# EasyEDA Pro project STEP Controller.eprj, board PCB1
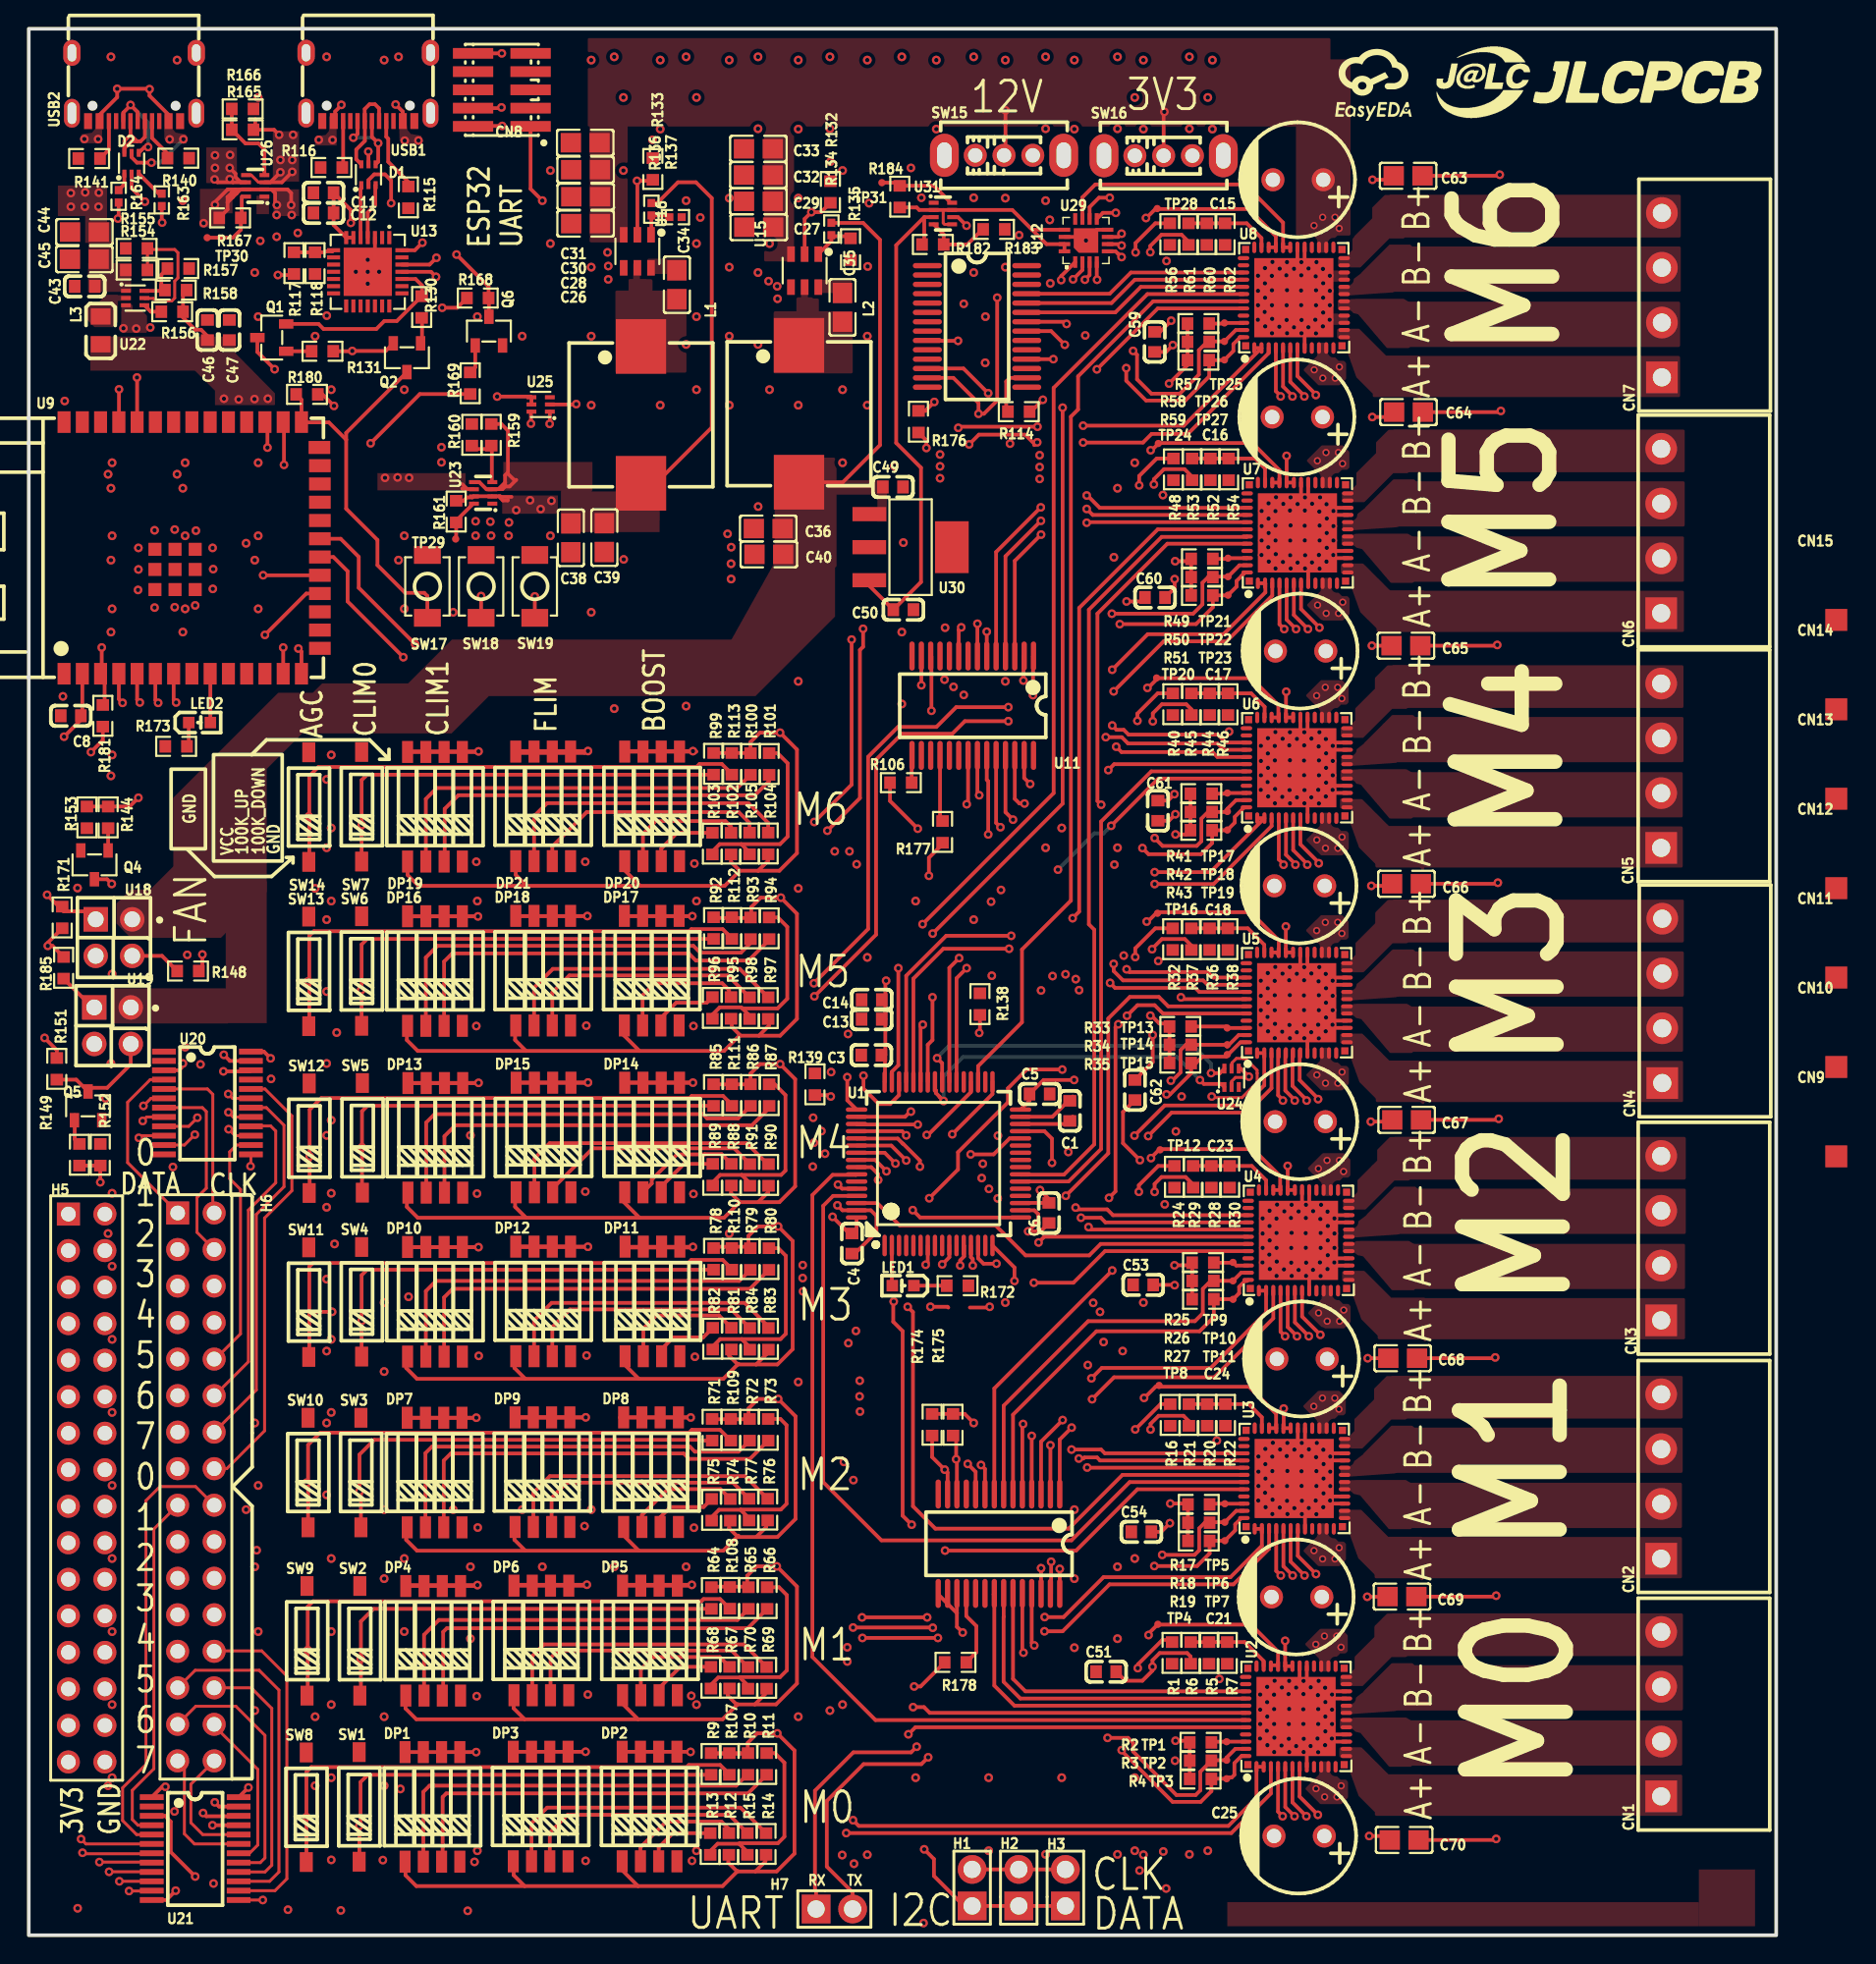
[diagram p3: board, top side]
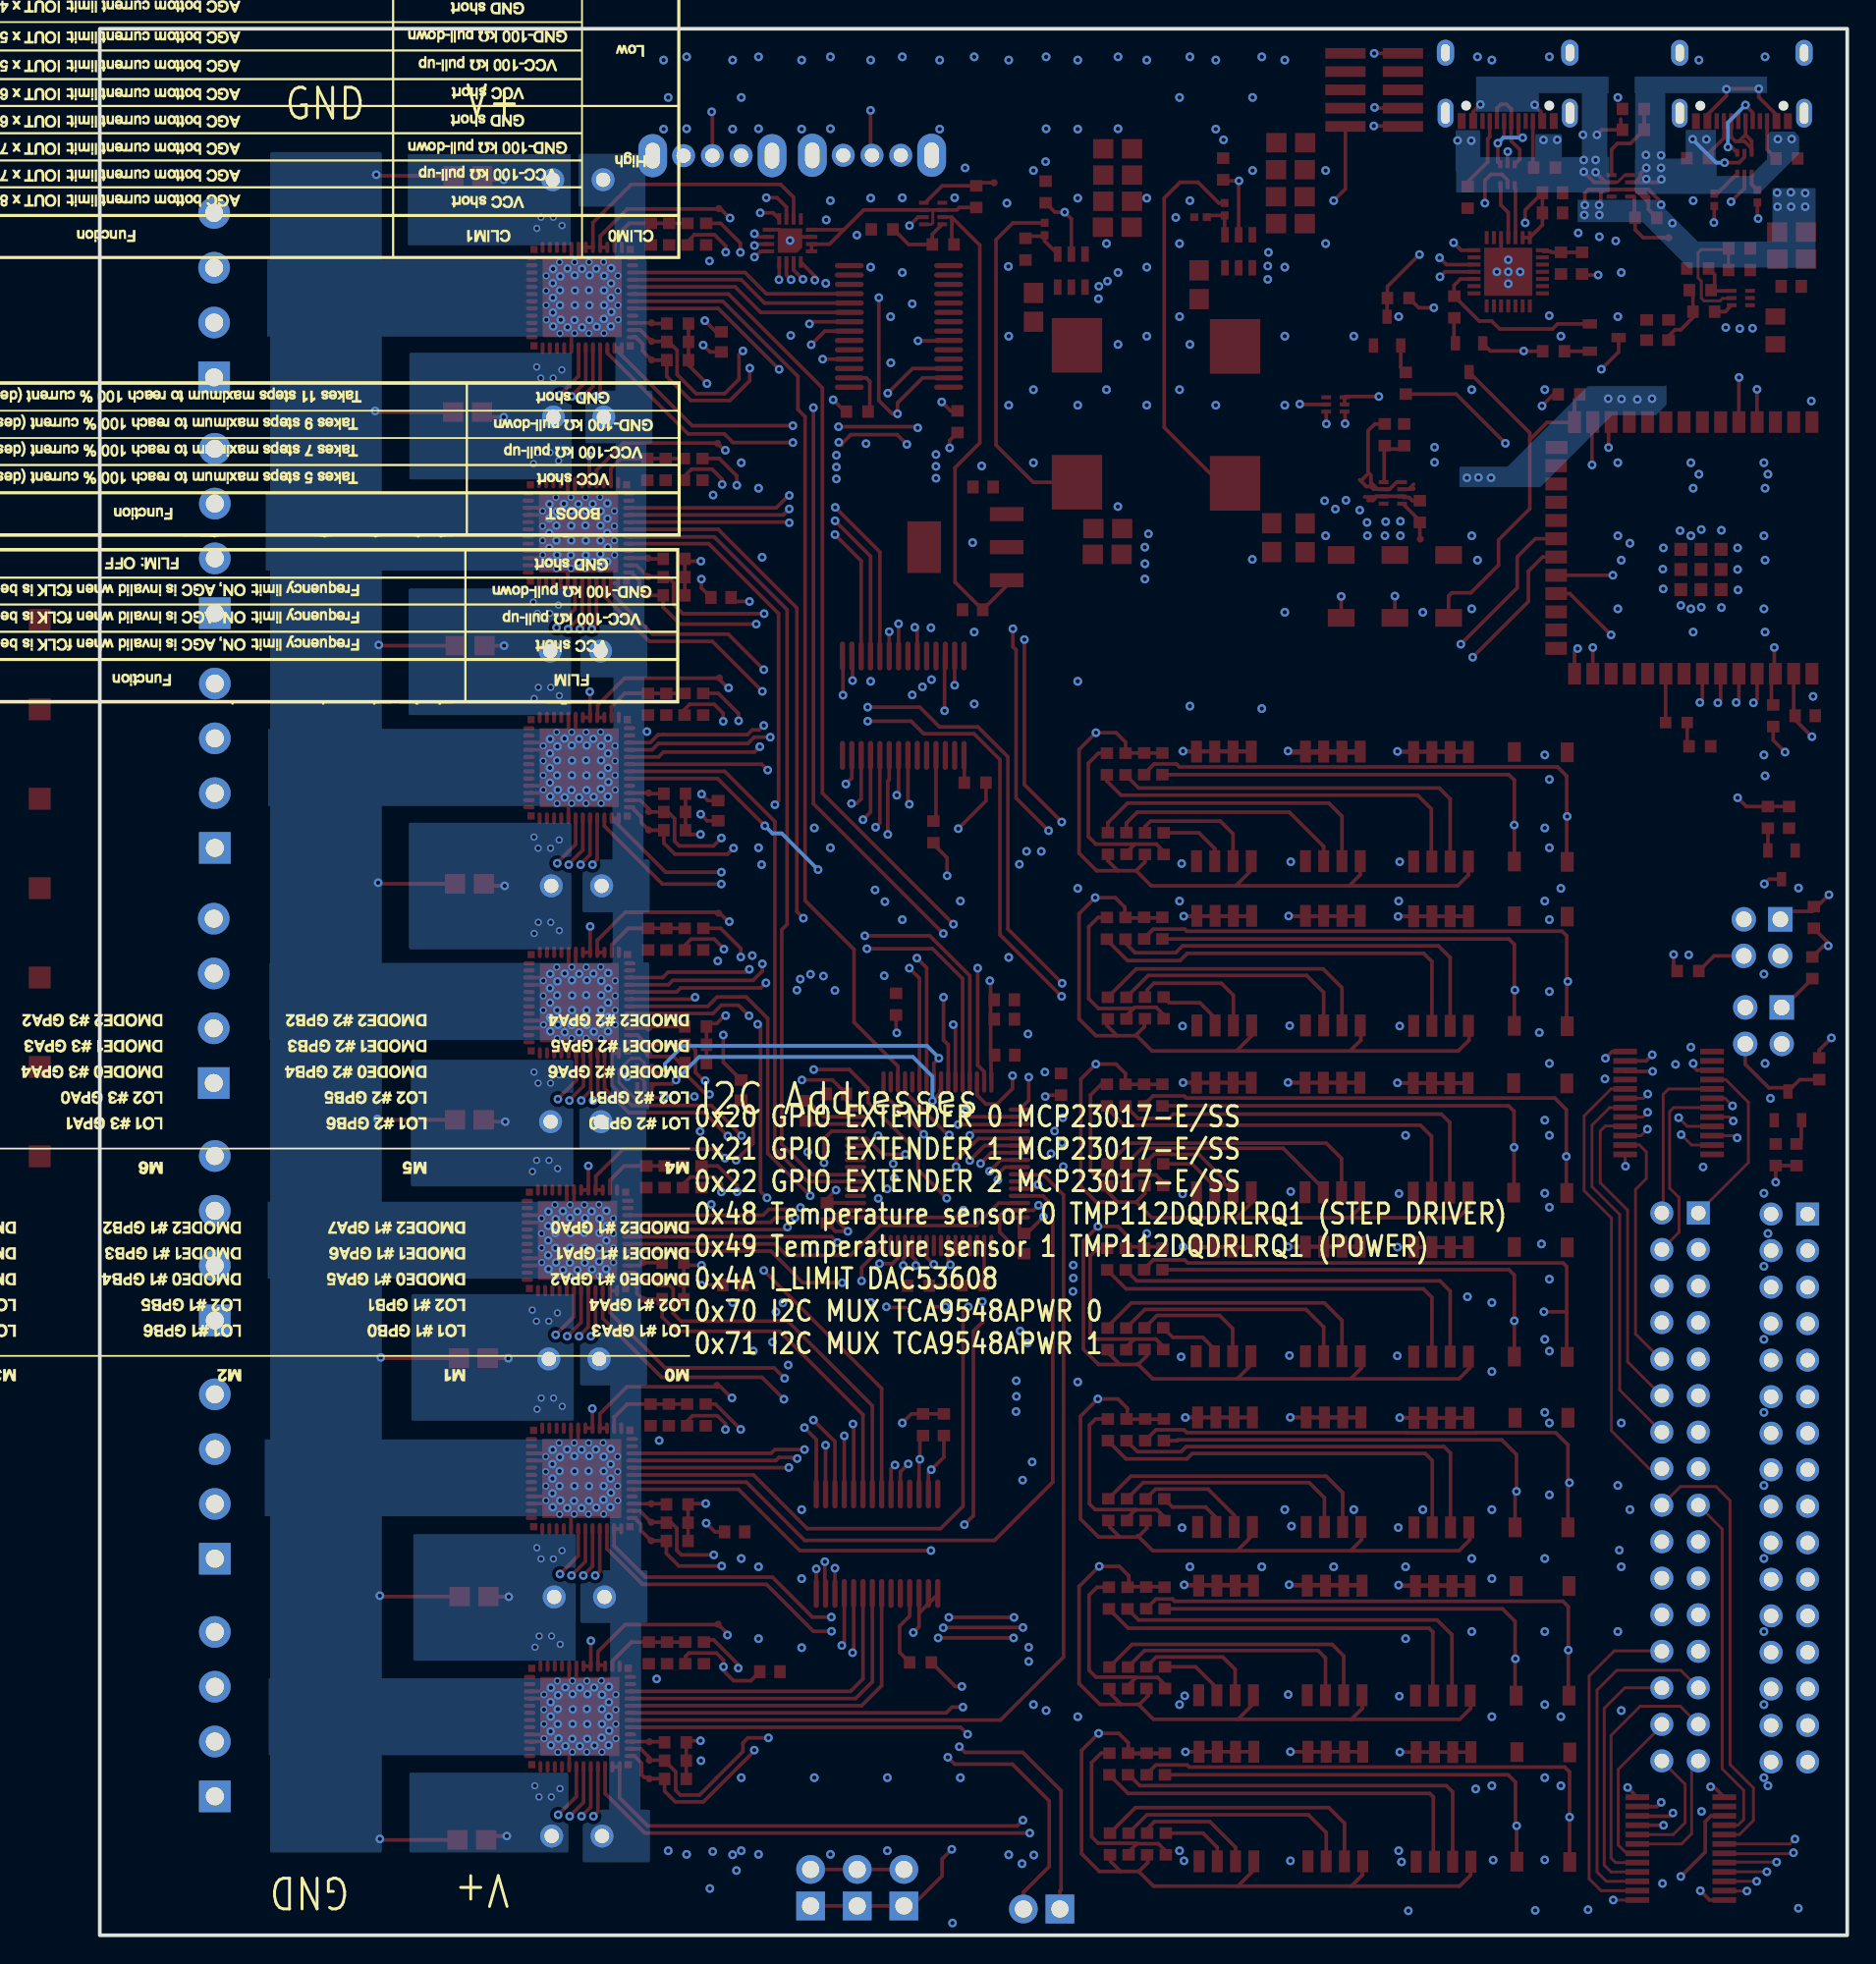
[diagram p4: board, bottom side, seen from below]

Outline 121.52 x 132.57 mm; copper layers: Top Layer, Inner1, Inner2, Bottom Layer. Coordinates in mm from the lower left corner of the outline.
Outline path: rectangle 0,132.57 121.52,0
Stack: Top Layer 0.035mm Outer layer thickness 1oz / Dielectric1 0.2104mm 7628 RC49% 8.6mil / Inner1 0.0152mm Inner layer thickness / Dielectric2 1.065mm 1.1mm H/HOZ Copper / Inner2 0.0152mm Inner layer thickness / Dielectric3 0.2104mm 7628 RC49% 8.6mil / Bottom Layer 0.035mm Outer layer thickness 1oz

## Design rules (mm)
template: Custom Config
spacing copperThickness1oz (default): track to track 0.102, other pairs 0.152 to 0.3
spacing copperThickness2oz: track to track 0.203, other pairs 0.152 to 0.3
track width copperThickness1oz (default): min 0.127, default 0.254, max 2.54
track width copperThickness2oz: min 0.203, default 0.254, max 2.54
differential pair differentialPair (default): width min 0.127, default 0.254, max 2.54; gap min 0.152, default 0.152
via viaSize (default): diameter min 0.5, default 0.61, max 10; hole min 0.3, default 0.305, max 6.3
net GND uses copperRegion1
net C6_OUT_B+ uses copperRegion1
net C7_OUT_B+ uses copperRegion1
net C7_OUT_B- uses copperRegion1
net C7_OUT_A- uses copperRegion1
net C7_OUT_A+ uses copperRegion1
net C1_OUT_A- uses copperRegion1
net C1_OUT_A+ uses copperRegion1

## Placement (name value [footprint] x y rotation side)
C1  2.2uF  [C0603]  72.4 57.32 270 top
C3  100nF  [C0603]  58.6 61.2 0 top
C4  100nF  [C0603]  57.25 48.1 90 top
C5  100nF  [C0603]  70.3 58.5 180 top
C6  100nF  [C0603]  70.95 50.23 90 top
C8  2.2uF  [C0603]  2.92 84.8 0 top
C11  4.7uF  [C0603]  20.5 121.17 0 top
C12  100nF  [C0603]  20.5 119.77 0 top
C13  100nF  [C0603]  58.62 63.7 0 top
C14  1uF  [C0603]  58.62 65.05 0 top
C15  100uF  [CAP-TH_BD8.0-P3.50-D0.6-FD_1]  88.27 122.07 180 top
C16  100uF  [CAP-TH_BD8.0-P3.50-D0.6-FD_1]  88.23 105.57 180 top
C17  100uF  [CAP-TH_BD8.0-P3.50-D0.6-FD_1]  88.45 89.3 180 top
C18  100uF  [CAP-TH_BD8.0-P3.50-D0.6-FD_1]  88.38 72.97 180 top
C21  100uF  [CAP-TH_BD8.0-P3.50-D0.6-FD_1]  88.17 23.53 180 top
C23  100uF  [CAP-TH_BD8.0-P3.50-D0.6-FD_1]  88.42 56.57 180 top
C24  100uF  [CAP-TH_BD8.0-P3.50-D0.6-FD_1]  88.55 40.07 180 top
C25  100uF  [CAP-TH_BD8.0-P3.50-D0.6-FD_1]  88.35 6.9 180 top
C26  100nF  [C0805]  38.73 119.02 0 top
C27  100nF  [C0805]  50.77 118.78 0 top
C28  1uF  [C0805]  38.73 120.9 0 top
C29  1uF  [C0805]  50.74 120.58 0 top
C30  1uF  [C0805]  38.73 122.77 0 top
C31  1uF  [C0805]  38.7 124.65 0 top
C32  1uF  [C0805]  50.74 122.4 0 top
C33  1uF  [C0805]  50.74 124.23 0 top
C34  100nF  [C0805]  45.08 114.77 90 top
C35  100nF  [C0805]  56.59 113.2 90 top
C36  10uF  [C0805]  51.43 97.82 0 top
C38  10uF  [C0805]  37.7 97.17 90 top
C39  10uF  [C0805]  40.03 97.19 90 top
C40  10uF  [C0805]  51.47 96.03 0 top
C43  100nF  [C0603]  3.89 114.66 0 top
C44  10uF  [C0805]  3.87 118.44 0 top
C45  10uF  [C0805]  3.86 116.55 0 top
C46  22uF  [C0603]  12.42 111.62 90 top
C47  100nF  [C0603]  13.95 111.62 270 top
C49  1uF  [C0603]  60.1 100.71 0 top
C50  1uF  [C0603]  60.83 92.17 180 top
C51  100nF  [C0603]  74.92 18.32 0 top
C53  100nF  [C0603]  77.5 45.22 0 top
C54  100nF  [C0603]  77.38 28.05 0 top
C59  100nF  [C0603]  78.3 110.8 270 top
C60  100nF  [C0603]  78.33 93.02 0 top
C61  100nF  [C0603]  78.52 78.2 270 top
C62  100nF  [C0603]  76.92 58.77 90 top
C63  100nF  [C0805]  95.92 122.35 180 top
C64  100nF  [C0805]  95.95 105.92 180 top
C65  100nF  [C0805]  95.77 89.67 180 top
C66  100nF  [C0805]  95.81 73.12 180 top
C67  100nF  [C0805]  95.83 56.7 180 top
C68  100nF  [C0805]  95.55 40.12 180 top
C69  100nF  [C0805]  95.5 23.55 180 top
C70  100nF  [C0805]  95.65 6.62 180 top
CN1  WJ15EDGRC-3.81-04P-14-00A  [CONN-TH_WJ15EDGRC-3.81-4P]  113.53 15.38 90 top
CN2  WJ15EDGRC-3.81-04P-14-00A  [CONN-TH_WJ15EDGRC-3.81-4P]  113.53 31.9 90 top
CN3  WJ15EDGRC-3.81-04P-14-00A  [CONN-TH_WJ15EDGRC-3.81-4P]  113.53 48.47 90 top
CN4  WJ15EDGRC-3.81-04P-14-00A  [CONN-TH_WJ15EDGRC-3.81-4P]  113.6 64.98 90 top
CN5  WJ15EDGRC-3.81-04P-14-00A  [CONN-TH_WJ15EDGRC-3.81-4P]  113.53 81.33 90 top
CN6  WJ15EDGRC-3.81-04P-14-00A  [CONN-TH_WJ15EDGRC-3.81-4P]  113.53 97.65 90 top
CN7  WJ15EDGRC-3.81-04P-14-00A  [CONN-TH_WJ15EDGRC-3.81-4P]  113.58 114.05 90 top
CN8  BH127VS-12-10-H25-L70-R  [CONN-SMD_10P-P1.27-V-M-R2-C5-LS5.8_BH127VS-12-10-H25-L70-R]  32.9 128.32 90 top
CN9  WJ15EDGK-3.81-04P-14-00A  [FL_001]  125.7 54.16 0 top
CN10  WJ15EDGK-3.81-04P-14-00A  [FL_001]  125.7 60.38 0 top
CN11  WJ15EDGK-3.81-04P-14-00A  [FL_001]  125.7 66.6 0 top
CN12  WJ15EDGK-3.81-04P-14-00A  [FL_001]  125.7 72.81 0 top
CN13  WJ15EDGK-3.81-04P-14-00A  [FL_001]  125.7 79.03 0 top
CN14  WJ15EDGK-3.81-04P-14-00A  [FL_001]  125.7 85.25 0 top
CN15  WJ15EDGK-3.81-04P-14-00A  [FL_001]  125.7 91.47 0 top
D1  USBLC6-2P6  [SOT-563_L1.6-W1.2-P0.50-LS1.6-BL]  23.62 122.42 0 top
D2  USBLC6-2P6  [SOT-563_L1.6-W1.2-P0.50-LS1.6-BL]  7.15 123.22 0 top
DP1  DSHP04TSGER  [SW-SMD_8P-L6.7-W5.4-P1.27-LS8.4]  28.08 8.92 0 top
DP2  DSHP04TSGER  [SW-SMD_8P-L6.7-W5.4-P1.27-LS8.4]  43.17 8.95 0 top
DP3  DSHP04TSGER  [SW-SMD_8P-L6.7-W5.4-P1.27-LS8.4]  35.6 8.95 0 top
DP4  DSHP04TSGER  [SW-SMD_8P-L6.7-W5.4-P1.27-LS8.4]  28.12 20.47 0 top
DP5  DSHP04TSGER  [SW-SMD_8P-L6.7-W5.4-P1.27-LS8.4]  43.2 20.5 0 top
DP6  DSHP04TSGER  [SW-SMD_8P-L6.7-W5.4-P1.27-LS8.4]  35.65 20.5 0 top
DP7  DSHP04TSGER  [SW-SMD_8P-L6.7-W5.4-P1.27-LS8.4]  28.23 32.17 0 top
DP8  DSHP04TSGER  [SW-SMD_8P-L6.7-W5.4-P1.27-LS8.4]  43.27 32.2 0 top
DP9  DSHP04TSGER  [SW-SMD_8P-L6.7-W5.4-P1.27-LS8.4]  35.73 32.2 0 top
DP10  DSHP04TSGER  [SW-SMD_8P-L6.7-W5.4-P1.27-LS8.4]  28.25 44.05 0 top
DP11  DSHP04TSGER  [SW-SMD_8P-L6.7-W5.4-P1.27-LS8.4]  43.38 44.07 0 top
DP12  DSHP04TSGER  [SW-SMD_8P-L6.7-W5.4-P1.27-LS8.4]  35.78 44.07 0 top
DP13  DSHP04TSGER  [SW-SMD_8P-L6.7-W5.4-P1.27-LS8.4]  28.28 55.45 0 top
DP14  DSHP04TSGER  [SW-SMD_8P-L6.7-W5.4-P1.27-LS8.4]  43.35 55.47 0 top
DP15  DSHP04TSGER  [SW-SMD_8P-L6.7-W5.4-P1.27-LS8.4]  35.8 55.47 0 top
DP16  DSHP04TSGER  [SW-SMD_8P-L6.7-W5.4-P1.27-LS8.4]  28.25 67.05 0 top
DP17  DSHP04TSGER  [SW-SMD_8P-L6.7-W5.4-P1.27-LS8.4]  43.33 67.07 0 top
DP18  DSHP04TSGER  [SW-SMD_8P-L6.7-W5.4-P1.27-LS8.4]  35.78 67.07 0 top
DP19  DSHP04TSGER  [SW-SMD_8P-L6.7-W5.4-P1.27-LS8.4]  28.25 78.47 0 top
DP20  DSHP04TSGER  [SW-SMD_8P-L6.7-W5.4-P1.27-LS8.4]  43.35 78.5 0 top
DP21  DSHP04TSGER  [SW-SMD_8P-L6.7-W5.4-P1.27-LS8.4]  35.78 78.5 0 top
H1  PZ254V-11-02P  [HDR-TH_2P-P2.54-V-M]  65.61 3.31 90 top
H2  PZ254V-11-02P  [HDR-TH_2P-P2.54-V-M]  68.85 3.31 90 top
H3  PZ254V-11-02P  [HDR-TH_2P-P2.54-V-M]  72.09 3.31 90 top
H5  P6E32E-602530-B1P  [HDR-TH_32P-P2.54_P6E32E-602530-B1P]  4.03 31.1 270 top
H6  P6E32E-602530-B1P  [HDR-TH_32P-P2.54_P6E32E-602530-B1P]  11.62 31.17 270 top
H7  PZ254V-11-02P  [HDR-TH_2P-P2.54-V-M]  56.02 1.82 0 top
L1  22uH  [IND-SMD_L10.0-W10.0-LS11.0]  42.58 105.72 270 top
L2  22uH  [IND-SMD_L10.0-W10.0-LS11.0]  53.57 105.8 270 top
L3  2.2uH  [L0805]  5 111.6 90 top
LED1  KT-0603R  [LED-SMD_L1.6-W0.8-R-RD]  60.81 45.17 180 top
LED2  KT-0603R  [LED-SMD_L1.6-W0.8-R-RD]  11.88 84.33 0 top
Q1  MMBT3904  [SOT-23-3_L2.9-W1.3-P1.90-LS2.4-BR]  16.9 111.1 0 top
Q2  MMBT3904  [SOT-23-3_L2.9-W1.3-P1.90-LS2.4-BR]  26.3 109.7 90 top
Q4  MMBT3904  [SOT-23-3_L2.9-W1.3-P1.90-LS2.4-BR]  4.57 74.43 90 top
Q5  MMBT3904  [SOT-23-3_L2.9-W1.3-P1.90-LS2.4-BR]  4.12 57.67 270 top
Q6  MMBT3904  [SOT-23-3_L2.9-W1.3-P1.90-LS2.4-BR]  32 111.55 270 top
R1  100kΩ  [R0603]  79.51 19.63 90 top
R2  10kΩ  [R0603]  81.49 13.41 180 top
R3  10kΩ  [R0603]  81.49 12.14 180 top
R4  10kΩ  [R0603]  81.49 10.87 180 top
R5  0Ω  [R0603]  82.08 19.63 90 top
R6  0Ω  [R0603]  80.81 19.63 270 top
R7  0Ω  [R0603]  83.35 19.63 270 top
R9  10kΩ  [R0603]  47.45 11.91 270 top
R10  100kΩ  [R0603]  50.02 11.91 270 top
R11  100kΩ  [R0603]  51.31 11.91 270 top
R12  100kΩ  [R0603]  48.69 6.35 90 top
R13  100kΩ  [R0603]  47.39 6.35 90 top
R14  100kΩ  [R0603]  51.27 6.35 90 top
R15  100kΩ  [R0603]  49.98 6.35 90 top
R16  100kΩ  [R0603]  79.39 36.18 90 top
R17  10kΩ  [R0603]  81.37 29.96 180 top
R18  10kΩ  [R0603]  81.37 28.69 180 top
R19  10kΩ  [R0603]  81.37 27.42 180 top
R20  0Ω  [R0603]  81.95 36.18 90 top
R21  0Ω  [R0603]  80.68 36.18 270 top
R22  0Ω  [R0603]  83.22 36.18 270 top
R24  100kΩ  [R0603]  79.68 52.74 90 top
R25  10kΩ  [R0603]  81.66 46.77 180 top
R26  10kΩ  [R0603]  81.66 45.5 180 top
R27  10kΩ  [R0603]  81.66 44.23 180 top
R28  0Ω  [R0603]  82.25 52.74 90 top
R29  0Ω  [R0603]  80.98 52.74 270 top
R30  0Ω  [R0603]  83.52 52.74 270 top
R32  100kΩ  [R0603]  79.55 69.27 90 top
R33  10kΩ  [R0603]  80.09 63.19 180 top
R34  10kΩ  [R0603]  80.09 61.92 180 top
R35  10kΩ  [R0603]  80.09 60.65 180 top
R36  0Ω  [R0603]  82.12 69.27 90 top
R37  0Ω  [R0603]  80.85 69.27 270 top
R38  0Ω  [R0603]  83.39 69.27 270 top
R40  100kΩ  [R0603]  79.56 85.6 90 top
R41  10kΩ  [R0603]  81.54 79.38 180 top
R42  10kΩ  [R0603]  81.54 78.11 180 top
R43  10kΩ  [R0603]  81.54 76.84 180 top
R44  0Ω  [R0603]  82.13 85.6 90 top
R45  0Ω  [R0603]  80.86 85.6 270 top
R46  0Ω  [R0603]  83.4 85.6 270 top
R48  100kΩ  [R0603]  79.61 101.94 90 top
R49  10kΩ  [R0603]  81.59 95.71 180 top
R50  10kΩ  [R0603]  81.59 94.44 180 top
R51  10kΩ  [R0603]  81.59 93.17 180 top
R52  0Ω  [R0603]  82.17 101.94 90 top
R53  0Ω  [R0603]  80.91 101.94 270 top
R54  0Ω  [R0603]  83.45 101.94 270 top
R56  100kΩ  [R0603]  79.36 118.29 90 top
R57  10kΩ  [R0603]  81.34 112.07 180 top
R58  10kΩ  [R0603]  81.34 110.8 180 top
R59  10kΩ  [R0603]  81.34 109.53 180 top
R60  0Ω  [R0603]  81.92 118.29 90 top
R61  0Ω  [R0603]  80.66 118.29 270 top
R62  0Ω  [R0603]  83.2 118.29 270 top
R64  10kΩ  [R0603]  47.48 23.45 270 top
R65  100kΩ  [R0603]  50.05 23.45 270 top
R66  100kΩ  [R0603]  51.35 23.45 270 top
R67  100kΩ  [R0603]  48.74 17.91 90 top
R68  100kΩ  [R0603]  47.44 17.91 90 top
R69  100kΩ  [R0603]  51.31 17.9 90 top
R70  100kΩ  [R0603]  50.02 17.9 90 top
R71  10kΩ  [R0603]  47.52 35.15 270 top
R72  100kΩ  [R0603]  50.13 35.15 270 top
R73  100kΩ  [R0603]  51.42 35.15 270 top
R74  100kΩ  [R0603]  48.79 29.58 90 top
R75  100kΩ  [R0603]  47.49 29.58 90 top
R76  100kΩ  [R0603]  51.39 29.6 90 top
R77  100kΩ  [R0603]  50.09 29.6 90 top
R78  10kΩ  [R0603]  47.63 47.03 270 top
R79  100kΩ  [R0603]  50.18 47.02 270 top
R80  100kΩ  [R0603]  51.47 47.02 270 top
R81  100kΩ  [R0603]  48.86 41.48 90 top
R82  100kΩ  [R0603]  47.57 41.48 90 top
R83  100kΩ  [R0603]  51.44 41.47 90 top
R84  100kΩ  [R0603]  50.14 41.47 90 top
R85  10kΩ  [R0603]  47.63 58.42 270 top
R86  100kΩ  [R0603]  50.19 58.42 270 top
R87  100kΩ  [R0603]  51.49 58.42 270 top
R88  100kΩ  [R0603]  48.86 52.88 90 top
R89  100kΩ  [R0603]  47.57 52.88 90 top
R90  100kΩ  [R0603]  51.45 52.87 90 top
R91  100kΩ  [R0603]  50.15 52.87 90 top
R92  10kΩ  [R0603]  47.63 70.03 270 top
R93  100kΩ  [R0603]  50.19 70.02 270 top
R94  100kΩ  [R0603]  51.49 70.02 270 top
R95  100kΩ  [R0603]  48.84 64.48 90 top
R96  100kΩ  [R0603]  47.54 64.48 90 top
R97  100kΩ  [R0603]  51.42 64.47 90 top
R98  100kΩ  [R0603]  50.13 64.47 90 top
R99  10kΩ  [R0603]  47.63 81.46 270 top
R100  100kΩ  [R0603]  50.19 81.45 270 top
R101  100kΩ  [R0603]  51.49 81.45 270 top
R102  100kΩ  [R0603]  48.84 75.91 90 top
R103  100kΩ  [R0603]  47.54 75.91 90 top
R104  100kΩ  [R0603]  51.42 75.92 90 top
R105  100kΩ  [R0603]  50.13 75.92 90 top
R106  10kΩ  [R0603]  60.65 80.15 180 top
R107  10kΩ  [R0603]  48.72 11.91 270 top
R108  10kΩ  [R0603]  48.75 23.46 270 top
R109  10kΩ  [R0603]  48.83 35.15 270 top
R110  10kΩ  [R0603]  48.9 47.03 270 top
R111  10kΩ  [R0603]  48.9 58.42 270 top
R112  10kΩ  [R0603]  48.9 70.03 270 top
R113  10kΩ  [R0603]  48.9 81.46 270 top
R114  10kΩ  [R0603]  68.85 105.95 0 top
R115  5.1kΩ  [R0603]  26.4 120.85 90 top
R116  5.1kΩ  [R0603]  21.05 122.92 0 top
R117  22kΩ  [R0603]  18.44 116.28 270 top
R118  47kΩ  [R0603]  19.91 116.28 270 top
R130  10kΩ  [R0603]  27.33 113.22 90 top
R131  10kΩ  [R0603]  20.42 110.15 0 top
R132  10kΩ  [R0603]  55.75 121.22 270 top
R133  10kΩ  [R0603]  43.4 122.82 270 top
R134  100kΩ  [R0402]  55.82 118.65 270 top
R135  6.8kΩ  [R0603]  57.15 117.25 270 top
R136  100kΩ  [R0402]  43.3 120.02 270 top
R137  33kΩ  [R0402]  44.98 119.47 0 top
R138  10kΩ  [R0603]  66.15 64.75 90 top
R139  10kΩ  [R0603]  54.67 59.17 270 top
R140  5.1kΩ  [R0603]  10.4 123.57 180 top
R141  5.1kΩ  [R0603]  4.2 123.55 0 top
R144  10kΩ  [R0603]  5.52 77.73 90 top
R148  10kΩ  [R0603]  11.08 67.05 0 top
R149  10kΩ  [R0603]  3.53 54.27 270 top
R151  10kΩ  [R0603]  1.95 60.25 90 top
R152  100kΩ  [R0603]  4.98 54.27 90 top
R153  100kΩ  [R0603]  4.05 77.73 270 top
R154  100kΩ  [R0603]  7.5 115.8 0 top
R155  43kΩ  [R0603]  7.5 117.3 180 top
R156  10kΩ  [R0603]  9.98 112.9 0 top
R157  10kΩ  [R0603]  10.4 115.9 0 top
R158  43kΩ  [R0603]  10.23 114.4 180 top
R159  10kΩ  [R0603]  32.16 104.34 270 top
R160  100kΩ  [R0603]  30.81 104.34 90 top
R161  10kΩ  [R0603]  29.73 99 90 top
R163  22Ω  [R0402]  9.25 120.67 90 top
R164  22Ω  [R0402]  6.25 120.92 90 top
R165  10kΩ  [R0603]  14.88 125.55 180 top
R166  100kΩ  [R0603]  14.88 127 0 top
R167  10kΩ  [R0603]  14 119.42 180 top
R168  10kΩ  [R0603]  31.23 113.85 0 top
R169  10kΩ  [R0603]  30.7 107.92 270 top
R171  10kΩ  [R0603]  2.33 70.77 270 top
R172  5.1kΩ  [R0603]  64.59 45.17 180 top
R173  5.1kΩ  [R0603]  10.25 82.67 0 top
R174  5.1kΩ  [R0603]  62.83 35.5 270 top
R175  5.1kΩ  [R0603]  64.27 35.5 270 top
R176  10kΩ  [R0603]  61.88 105.25 270 top
R177  10kΩ  [R0603]  63.55 76.72 270 top
R178  10kΩ  [R0603]  64.45 18.97 180 top
R180  10kΩ  [R0603]  19.35 107.15 180 top
R181  10kΩ  [R0603]  5.15 84.8 90 top
R182  10kΩ  [R0603]  62.88 117.57 0 top
R183  100kΩ  [R0603]  67.13 118.62 0 top
R184  10kΩ  [R0603]  60.58 120.9 270 top
R185  10kΩ  [R0603]  2.42 67.27 270 top
SW1  DSHP01TSGER  [SW-SMD_DSHP01TSGER]  22.98 8.92 0 top
SW2  DSHP01TSGER  [SW-SMD_DSHP01TSGER]  23.03 20.47 0 top
SW3  DSHP01TSGER  [SW-SMD_DSHP01TSGER]  23.1 32.17 0 top
SW4  DSHP01TSGER  [SW-SMD_DSHP01TSGER]  23.15 44.05 0 top
SW5  DSHP01TSGER  [SW-SMD_DSHP01TSGER]  23.2 55.45 0 top
SW6  DSHP01TSGER  [SW-SMD_DSHP01TSGER]  23.15 67.05 0 top
SW7  DSHP01TSGER  [SW-SMD_DSHP01TSGER]  23.15 78.47 0 top
SW8  DSHP01TSGER  [SW-SMD_DSHP01TSGER]  19.3 8.9 0 top
SW9  DSHP01TSGER  [SW-SMD_DSHP01TSGER]  19.35 20.47 0 top
SW10  DSHP01TSGER  [SW-SMD_DSHP01TSGER]  19.42 32.17 0 top
SW11  DSHP01TSGER  [SW-SMD_DSHP01TSGER]  19.48 44.02 0 top
SW12  DSHP01TSGER  [SW-SMD_DSHP01TSGER]  19.5 55.42 0 top
SW13  DSHP01TSGER  [SW-SMD_DSHP01TSGER]  19.48 67.02 0 top
SW14  DSHP01TSGER  [SW-SMD_DSHP01TSGER]  19.48 78.45 0 top
SW15  SS12D07VG4 087  [SW-TH_SS12D07VG4]  67.83 123.77 0 top
SW16  SS12D07VG4 087  [SW-TH_SS12D07VG4]  78.92 123.75 0 top
SW17  TS-1088-AR02016  [SW-SMD_L3.9-W3.0-P4.45]  27.72 93.8 90 top
SW18  TS-1088-AR02016  [SW-SMD_L3.9-W3.0-P4.45]  31.46 93.8 90 top
SW19  TS-1088-AR02016  [SW-SMD_L3.9-W3.0-P4.45]  35.19 93.8 90 top
TP1  -  [Test-Point-0.5mm]  83.3 13.46 0 top
TP2  -  [Test-Point-0.5mm]  83.3 12.17 0 top
TP3  -  [Test-Point-0.5mm]  83.3 10.88 0 top
TP4  -  [Test-Point-0.5mm]  78.52 21.62 0 top
TP5  -  [Test-Point-0.5mm]  83.18 30.01 0 top
TP6  -  [Test-Point-0.5mm]  83.18 28.72 0 top
TP7  -  [Test-Point-0.5mm]  83.18 27.43 0 top
TP8  -  [Test-Point-0.5mm]  78.61 38.23 0 top
TP9  -  [Test-Point-0.5mm]  83.75 46.79 0 top
TP10  -  [Test-Point-0.5mm]  83.75 45.51 0 top
TP11  -  [Test-Point-0.5mm]  83.75 44.22 0 top
TP12  -  [Test-Point-0.5mm]  78.68 54.62 0 top
TP13  -  [Test-Point-0.5mm]  83.35 63.09 0 top
TP14  -  [Test-Point-0.5mm]  83.35 61.93 0 top
TP15  -  [Test-Point-0.5mm]  83.35 61.24 0 top
TP16  -  [Test-Point-0.5mm]  78.5 71.07 0 top
TP17  -  [Test-Point-0.5mm]  83.36 79.43 0 top
TP18  -  [Test-Point-0.5mm]  83.36 78.14 0 top
TP19  -  [Test-Point-0.5mm]  83.36 76.86 0 top
TP20  -  [Test-Point-0.5mm]  78.43 87.43 0 top
TP21  -  [Test-Point-0.5mm]  83.4 95.76 0 top
TP22  -  [Test-Point-0.5mm]  83.4 94.47 0 top
TP23  -  [Test-Point-0.5mm]  83.4 93.19 0 top
TP24  -  [Test-Point-0.5mm]  78.56 103.74 0 top
TP25  -  [Test-Point-0.5mm]  83.15 112.12 0 top
TP26  -  [Test-Point-0.5mm]  83.15 110.83 0 top
TP27  -  [Test-Point-0.5mm]  83.15 109.55 0 top
TP28  -  [Test-Point-0.5mm]  78.48 120.07 0 top
TP29  -  [Test-Point-0.5mm]  29.69 97.09 90 top
TP30  -  [Test-Point-0.5mm]  12.41 118.05 0 top
TP31  -  [Test-Point-0.5mm]  59.33 121.87 0 top
U1  STM32F446RET6  [LQFP-64_L10.0-W10.0-P0.50-LS12.0-BL]  63.27 53.65 0 top
U2  TB67S249FTG,EL  [P-VQFN-48_L7.0-W7.0-P0.50-BL-EP5.5]  88.13 15.21 0 top
U3  TB67S249FTG,EL  [P-VQFN-48_L7.0-W7.0-P0.50-BL-EP5.5]  88.01 31.76 0 top
U4  TB67S249FTG,EL  [P-VQFN-48_L7.0-W7.0-P0.50-BL-EP5.5]  88.3 48.32 0 top
U5  TB67S249FTG,EL  [P-VQFN-48_L7.0-W7.0-P0.50-BL-EP5.5]  88.17 64.85 0 top
U6  TB67S249FTG,EL  [P-VQFN-48_L7.0-W7.0-P0.50-BL-EP5.5]  88.18 81.18 0 top
U7  TB67S249FTG,EL  [P-VQFN-48_L7.0-W7.0-P0.50-BL-EP5.5]  88.23 97.52 0 top
U8  TB67S249FTG,EL  [P-VQFN-48_L7.0-W7.0-P0.50-BL-EP5.5]  87.98 113.88 0 top
U9  2.4GHz  [WIRELM-SMD_ESP32-S3-WROOM-1]  11.35 96.47 90 top
U10  MCP23017-E/SS  [SSOP-28_L10.2-W5.3-P0.65-LS7.8-BL]  67.48 27.22 180 top
U11  MCP23017-E/SS  [SSOP-28_L10.2-W5.3-P0.65-LS7.8-BL]  65.65 85.5 180 top
U12  MCP23017-E/SS  [SSOP-28_L10.2-W5.3-P0.65-LS7.8-BL]  65.95 111.88 270 top
U13  CP2102N-A02-GQFN28R  [QFN-28_L5.0-W5.0-P0.50-TL-EP3.3]  23.58 115.67 270 top
U15  LMR51625XDDCR  [SOT-23-6_L2.9-W1.6-P0.95-LS2.9-BL]  53.96 115.76 180 top
U16  LMR51625XDDCR  [SOT-23-6_L2.9-W1.6-P0.95-LS2.9-BL]  42.33 117.1 180 top
U18  ZX-PZ2.54-2-2PZZ  [HDR-TH_4P-P2.54-V-M-R2-C2-S2.54]  5.92 69.38 270 top
U19  ZX-PZ2.54-2-2PZZ  [HDR-TH_4P-P2.54-V-M-R2-C2-S2.54]  5.83 63.25 270 top
U20  TCA9548APWR  [TSSOP-24_L7.8-W4.4-P0.65-LS6.4-BL]  12.42 57.88 270 top
U21  TCA9548APWR  [TSSOP-24_L7.8-W4.4-P0.65-LS6.4-BL]  11.58 6.03 270 top
U22  TPS563252DRLR  [SOT-563-6_L1.6-W1.2-P0.50-LS1.6-BL]  7.4 113.85 270 top
U23  TPS2116DRLR  [SOT-583-8_L2.1-W1.6-P0.50-LS1.6-BL]  31.6 100.3 90 top
U24  TMP112DQDRLRQ1  [SOT-563-6_L1.6-W1.2-P0.50-LS1.6-BL]  83.65 59.62 0 top
U25  TMP112DQDRLRQ1  [SOT-563-6_L1.6-W1.2-P0.50-LS1.6-BL]  35.6 106.45 90 top
U26  TPS2116DRLR  [SOT-583-8_L2.1-W1.6-P0.50-LS1.6-BL]  15.75 121.65 90 top
U29  DAC53608RTER  [WQFN-16_L3.0-W3.0-P0.50-BL-EP1.7]  73.52 117.85 0 top
U30  MCP1799-5002H/DB  [SOT-223-3_L6.7-W3.7-P2.30-LS7.0-BR]  61.33 96.52 180 top
U31  TPS2116DRLR  [SOT-583-8_L2.1-W1.6-P0.50-LS1.6-BL]  63.58 119.72 270 top
USB1  TYPE-C 16PIN 2MD(073)  [USB-C-SMD_TYPE-C-16PIN-2MD-073]  23.61 128.53 180 top
USB2  TYPE-C 16PIN 2MD(073)  [USB-C-SMD_TYPE-C-16PIN-2MD-073]  7.33 128.52 180 top

## Footprints (pads in the part's own frame, mm; a bottom-side part is the same pattern mirrored in y, then rotated)
C0603
  rect 0.8x0.9 smd: 1(-0.7,0) 2(0.7,0)
C0805
  rect 1.41x1.35 smd: 1(-1,0) 2(1,0)
CAP-TH_BD8.0-P3.50-D0.6-FD_1
  round 1.6 hole 1: 1(-1.75,0) 2(1.75,0)
CONN-SMD_10P-P1.27-V-M-R2-C5-LS5.8_BH127VS-12-10-H25-L70-R
  rect 0.74x2.8 smd: 1(-2.54,-2) 2(-2.54,2) 3(-1.27,-2) 4(-1.27,2) 5(0,-2) 6(0,2) 7(1.27,-2) 8(1.27,2) 9(2.54,-2) 10(2.54,2)
CONN-TH_WJ15EDGRC-3.81-4P
  rect 2.2x2.2 hole 1.26: 1(-5.715,0)
  round 2.2 hole 1.26: 2(-1.905,0) 3(1.905,0) 4(5.715,0)
FL_001
  rect 1.524x1.524 smd: 1(0,0)
HDR-TH_2P-P2.54-V-M
  rect 2x2 hole 1.2: 1(-1.27,0)
  round 2 hole 1.2: 2(1.27,0)
HDR-TH_4P-P2.54-V-M-R2-C2-S2.54
  rect 1.7x1.7 hole 1.1: 1(-1.27,-1.27)
  round 1.7 hole 1.1: 2(-1.27,1.27) 3(1.27,-1.27) 4(1.27,1.27)
HDR-TH_32P-P2.54_P6E32E-602530-B1P
  rect 1.6x1.6 hole 1.02: 1(-19.05,-1.27)
  round 1.6 hole 1.02: 2(-19.05,1.27) 3(-16.51,-1.27) 4(-16.51,1.27) 5(-13.97,-1.27) 6(-13.97,1.27) 7(-11.43,-1.27) 8(-11.43,1.27) 9(-8.89,-1.27) 10(-8.89,1.27) 11(-6.35,-1.27) 12(-6.35,1.27) 13(-3.81,-1.27) 14(-3.81,1.27) 15(-1.27,-1.27) 16(-1.27,1.27) 17(1.27,-1.27) 18(1.27,1.27) 19(3.81,-1.27) 20(3.81,1.27) 21(6.35,-1.27) 22(6.35,1.27) 23(8.89,-1.27) 24(8.89,1.27) 25(11.43,-1.27) 26(11.43,1.27) 27(13.97,-1.27) 28(13.97,1.27) 29(16.51,-1.27) 30(16.51,1.27) 31(19.05,-1.27) 32(19.05,1.27)
IND-SMD_L10.0-W10.0-LS11.0
  rect 3.8x3.5 smd: 1(-4.759,0) 2(4.759,0)
L0805
  rect 1.133x1.377 smd: 1(-0.966,0) 2(0.966,0)
LED-SMD_L1.6-W0.8-R-RD
  rect 0.8x0.8 smd: 1(0.75,0) 2(-0.75,0)
LQFP-64_L10.0-W10.0-P0.50-LS12.0-BL
  oval 0.3x1.5 smd: 1(-3.75,-5.688) 2(-3.25,-5.688) 3(-2.75,-5.688) 4(-2.25,-5.688) 5(-1.75,-5.688) 6(-1.25,-5.688) 7(-0.75,-5.688) 8(-0.25,-5.688) 9(0.25,-5.688) 10(0.75,-5.688) 11(1.25,-5.688) 12(1.75,-5.688) 13(2.25,-5.688) 14(2.75,-5.688) 15(3.25,-5.688) 16(3.75,-5.688) 33(3.75,5.688) 34(3.25,5.688) 35(2.75,5.688) 36(2.25,5.688) 37(1.75,5.688) 38(1.25,5.688) 39(0.75,5.688) 40(0.25,5.688) 41(-0.25,5.688) 42(-0.75,5.688) 43(-1.25,5.688) 44(-1.75,5.688) 45(-2.25,5.688) 46(-2.75,5.688) 47(-3.25,5.688) 48(-3.75,5.688)
  oval 1.5x0.3 smd: 17(5.7,-3.738) 18(5.7,-3.238) 19(5.7,-2.738) 20(5.7,-2.238) 21(5.7,-1.738) 22(5.7,-1.238) 23(5.7,-0.739) 24(5.7,-0.238) 25(5.7,0.262) 26(5.7,0.762) 27(5.7,1.262) 28(5.7,1.762) 29(5.7,2.261) 30(5.7,2.762) 31(5.7,3.261) 32(5.7,3.762) 49(-5.7,3.762) 50(-5.7,3.261) 51(-5.7,2.762) 52(-5.7,2.261) 53(-5.7,1.762) 54(-5.7,1.262) 55(-5.7,0.762) 56(-5.7,0.262) 57(-5.7,-0.238) 58(-5.7,-0.739) 59(-5.7,-1.238) 60(-5.7,-1.738) 61(-5.7,-2.238) 62(-5.7,-2.738) 63(-5.7,-3.238) 64(-5.7,-3.738)
P-VQFN-48_L7.0-W7.0-P0.50-BL-EP5.5
  oval 0.28x0.8 smd: 1(-2.75,-3.5) 2(-2.251,-3.5) 3(-1.75,-3.5) 4(-1.25,-3.5) 5(-0.75,-3.5) 6(-0.25,-3.5) 7(0.25,-3.5) 8(0.75,-3.5) 9(1.25,-3.5) 10(1.75,-3.5) 11(2.25,-3.5) 12(2.75,-3.5) 25(2.75,3.5) 26(2.25,3.5) 27(1.75,3.5) 28(1.25,3.5) 29(0.75,3.5) 30(0.25,3.5) 31(-0.25,3.5) 32(-0.75,3.5) 33(-1.25,3.5) 34(-1.75,3.5) 35(-2.251,3.5) 36(-2.75,3.5)
  oval 0.8x0.28 smd: 13(3.5,-2.75) 14(3.5,-2.25) 15(3.5,-1.75) 16(3.5,-1.25) 17(3.5,-0.75) 18(3.5,-0.25) 19(3.5,0.251) 20(3.5,0.75) 21(3.5,1.25) 22(3.5,1.75) 23(3.5,2.251) 24(3.5,2.75) 37(-3.5,2.75) 38(-3.5,2.251) 39(-3.5,1.75) 40(-3.5,1.25) 41(-3.5,0.75) 42(-3.5,0.251) 43(-3.5,-0.25) 44(-3.5,-0.75) 45(-3.5,-1.25) 46(-3.5,-1.75) 47(-3.5,-2.25) 48(-3.5,-2.75)
  rect 5.5x5.5 smd: 49(0,0)
  rect 0.5x0.5 smd: 50(3.35,-3.35) 51(3.35,3.35) 52(-3.35,3.35) 53(-3.35,-3.35)
QFN-28_L5.0-W5.0-P0.50-TL-EP3.3
  rect 0.905x0.28 smd: 1(-2.377,1.5) 2(-2.377,1) 3(-2.377,0.5) 4(-2.377,0) 5(-2.377,-0.5) 6(-2.377,-1) 7(-2.377,-1.5) 15(2.377,-1.5) 16(2.377,-1) 17(2.377,-0.5) 18(2.377,0) 19(2.377,0.5) 20(2.377,1) 21(2.377,1.5)
  rect 0.28x0.905 smd: 8(-1.5,-2.377) 9(-1,-2.377) 10(-0.5,-2.377) 11(0,-2.377) 12(0.5,-2.377) 13(1,-2.377) 14(1.5,-2.377) 22(1.5,2.377) 23(1,2.377) 24(0.5,2.377) 25(0,2.377) 26(-0.5,2.377) 27(-1,2.377) 28(-1.5,2.377)
  rect 3.35x3.35 smd: 29(0,0)
R0402
  rect 0.566x0.54 smd: 1(-0.433,0) 2(0.433,0)
R0603
  rect 0.806x0.864 smd: 1(-0.753,0) 2(0.753,0)
SOT-23-3_L2.9-W1.3-P1.90-LS2.4-BR
  rect 1x0.65 smd: 1(1,-0.95) 2(1,0.95) 3(-1,0)
SOT-23-6_L2.9-W1.6-P0.95-LS2.9-BL
  rect 0.532x1.072 smd: 1(-0.95,-1.149) 2(0,-1.149) 3(0.95,-1.149) 4(0.95,1.149) 5(0,1.149) 6(-0.95,1.149)
SOT-223-3_L6.7-W3.7-P2.30-LS7.0-BR
  rect 2.34x0.98 smd: 1(2.87,-2.3) 2(2.87,0) 3(2.87,2.3)
  rect 2.34x3.6 smd: 4(-2.87,0)
SOT-563-6_L1.6-W1.2-P0.50-LS1.6-BL
  rect 0.28x0.68 smd: 1(-0.5,-0.64) 2(0,-0.64) 3(0.5,-0.64) 4(0.5,0.64) 5(0,0.64) 6(-0.5,0.64)
SOT-563_L1.6-W1.2-P0.50-LS1.6-BL
  rect 0.28x0.545 smd: 1(-0.5,-0.723) 2(0,-0.723) 3(0.5,-0.723) 4(0.5,0.723) 5(0,0.723) 6(-0.5,0.723)
SOT-583-8_L2.1-W1.6-P0.50-LS1.6-BL
  rect 0.28x0.68 smd: 1(-0.75,-0.64) 2(-0.25,-0.64) 3(0.25,-0.64) 4(0.75,-0.64) 5(0.75,0.64) 6(0.25,0.64) 7(-0.25,0.64) 8(-0.75,0.64)
SSOP-28_L10.2-W5.3-P0.65-LS7.8-BL
  oval 0.364x2.015 smd: 1(-4.225,-3.455) 2(-3.575,-3.455) 3(-2.925,-3.455) 4(-2.275,-3.455) 5(-1.625,-3.455) 6(-0.975,-3.455) 7(-0.325,-3.455) 8(0.325,-3.455) 9(0.975,-3.455) 10(1.625,-3.455) 11(2.275,-3.455) 12(2.925,-3.455) 13(3.575,-3.455) 14(4.225,-3.455) 15(4.225,3.455) 16(3.575,3.455) 17(2.925,3.455) 18(2.275,3.455) 19(1.625,3.455) 20(0.975,3.455) 21(0.325,3.455) 22(-0.325,3.455) 23(-0.975,3.455) 24(-1.625,3.455) 25(-2.275,3.455) 26(-2.925,3.455) 27(-3.575,3.455) 28(-4.225,3.455)
SW-SMD_8P-L6.7-W5.4-P1.27-LS8.4
  rect 0.762x1.524 smd: 1(-1.905,-3.81) 2(-0.635,-3.81) 3(0.635,-3.81) 4(1.905,-3.81) 5(1.905,3.81) 6(0.635,3.81) 7(-0.635,3.81) 8(-1.905,3.81)
SW-SMD_DSHP01TSGER
  rect 0.9x1.37 smd: 1(0,3.81) 2(0,-3.81)
SW-SMD_L3.9-W3.0-P4.45
  rect 1.23x1.86 smd: 1(-2.185,0) 2(2.185,0)
SW-TH_SS12D07VG4
  oval 1.6x1.6 hole 1: 1(-2,0) 2(0,0) 3(2,0)
  oval 2x3 hole 1x1.8: 4(4.15,0) 5(-4.15,0)
Test-Point-0.5mm
  round 0.5 smd: 1(0,0)
TSSOP-24_L7.8-W4.4-P0.65-LS6.4-BL
  rect 0.4x1.65 smd: 1(-3.575,-3.022) 2(-2.925,-3.022) 3(-2.275,-3.022) 4(-1.625,-3.022) 5(-0.975,-3.022) 6(-0.325,-3.022) 7(0.325,-3.022) 8(0.975,-3.022) 9(1.625,-3.022) 10(2.275,-3.022) 11(2.925,-3.022) 12(3.575,-3.022) 13(3.575,3.022) 14(2.925,3.022) 15(2.275,3.022) 16(1.625,3.022) 17(0.975,3.022) 18(0.325,3.022) 19(-0.325,3.022) 20(-0.975,3.022) 21(-1.625,3.022) 22(-2.275,3.022) 23(-2.925,3.022) 24(-3.575,3.022)
USB-C-SMD_TYPE-C-16PIN-2MD-073
  oval 1.1x2 hole 0.6x1.5: 13(-4.325,1.825) 14(4.325,1.825)
  oval 1.2x1.8 hole 0.6x1.2: 13(-4.325,-2.375) 14(4.325,-2.375)
  rect 0.55x1.1 smd: A1B12(-3.2,2.375) A4B9(-2.4,2.375) B1A12(3.2,2.375) B4A9(2.4,2.375)
  rect 0.3x1.1 smd: A5(-1.25,2.375) A6(-0.25,2.375) A7(0.25,2.375) A8(1.25,2.375) B5(1.75,2.375) B6(0.75,2.375) B7(-0.75,2.375) B8(-1.75,2.375)
WIRELM-SMD_ESP32-S3-WROOM-1
  rect 1.5x0.9 smd: 1(-8.75,8.895) 2(-8.75,7.625) 3(-8.75,6.355) 4(-8.75,5.085) 5(-8.75,3.815) 6(-8.75,2.545) 7(-8.75,1.275) 8(-8.75,0.005) 9(-8.75,-1.265) 10(-8.75,-2.535) 11(-8.75,-3.805) 12(-8.75,-5.075) 13(-8.75,-6.345) 14(-8.75,-7.615) 27(8.75,-7.615) 28(8.75,-6.345) 29(8.75,-5.075) 30(8.75,-3.805) 31(8.75,-2.535) 32(8.75,-1.265) 33(8.75,0.005) 34(8.75,1.275) 35(8.75,2.545) 36(8.75,3.815) 37(8.75,5.085) 38(8.75,6.355) 39(8.75,7.625) 40(8.75,8.895)
  rect 0.9x1.5 smd: 15(-6.985,-8.895) 16(-5.715,-8.895) 17(-4.445,-8.895) 18(-3.175,-8.895) 19(-1.905,-8.895) 20(-0.635,-8.895) 21(0.635,-8.895) 22(1.905,-8.895) 23(3.175,-8.895) 24(4.445,-8.895) 25(5.715,-8.895) 26(6.985,-8.865)
  rect 0.9x0.9 smd: 41(-2.9,2.575) 41(-2.9,1.175) 41(-2.9,-0.225) 41(-1.5,2.575) 41(-1.5,1.175) 41(-1.5,-0.225) 41(-0.1,2.575) 41(-0.1,1.175) 41(-0.1,-0.225)
WQFN-16_L3.0-W3.0-P0.50-BL-EP1.7
  rect 0.28x0.8 smd: 1(-0.75,-1.5) 2(-0.25,-1.5) 3(0.25,-1.5) 4(0.75,-1.5) 9(0.75,1.5) 10(0.25,1.5) 11(-0.25,1.5) 12(-0.75,1.5)
  rect 0.8x0.28 smd: 5(1.5,-0.75) 6(1.5,-0.25) 7(1.5,0.25) 8(1.5,0.75) 13(-1.5,0.75) 14(-1.5,0.25) 15(-1.5,-0.25) 16(-1.5,-0.75)
  custom 1.7x1.7 smd: 17(0,0)

## Nets
As in the schematic.

Pads without a net: CN8 6 7 8 9; CN9 1; CN10 1; CN11 1; CN12 1; CN13 1; CN14 1; CN15 1; SW15 3; SW16 3; U1 1 3 4 5 6 15 20 21 34 37 59; U2 9 12 25 28 36 37 38 45 50 51 52 53; U3 9 12 25 28 36 37 38 45 50 51 52 53; U4 9 12 25 28 36 37 38 45 50 51 52 53; U5 9 12 25 28 36 37 38 45 50 51 52 53; U6 9 12 25 28 36 37 38 45 50 51 52 53; U7 9 12 25 28 36 37 38 45 50 51 52 53; U8 9 12 25 28 36 37 38 45 50 51 52 53; U9 8 10 11 12 15 16 17 22 23 24 25 26 30 31 32 33 34 35 38 39; U10 11 14 19 20; U11 8 11 14 19 20 28; U12 1 2 3 4 5 6 7 8 11 14 19 20 26 27 28; U13 1 2 9 10 11 12 13 14 15 16 17 18 19 20 21 22 23 27; U24 3; U25 3; U29 12; USB1 A8 B8; USB2 A8 B8

## Via types
v1: diameter 0.61, hole 0.305, Top Layer to Bottom Layer, 292 vias
v2: diameter 0.6, hole 0.3, Top Layer to Bottom Layer, 770 vias
v3: diameter 0.5, hole 0.3, Top Layer to Bottom Layer, 168 vias

## Routing (per net, layer and track width the routed paths; a pad name or vN(x,y) marks a point on that pad's centre or on a via; arc(x,y) is an arc through that point)
3V3: length 124.6
  Top Layer w0.2: v2(82.27,58.32) 82.34,58.25 84.38,58.25 85.43,59.31 85.43,59.95 85.42,59.95 85.42,60.15 84.61,60.97 84.46,60.97 84.45,60.97 83.98,60.97 83.68,60.67 83.68,60.34
  Top Layer w0.254: v2(66.23,32.7) 66.5,32.42 U10.9 ; v2(62.6,73.67) 62.6,74.92 63.55,75.88 R177.2 ; v2(11.58,4.09) 9.88,5.78 9.88,7.9 9.48,8.3 U21.3 ; R176.2 62.42,103.95 v2(62.42,103.42) ; R41.2 R42.2 R43.2 80.5,76.55 v2(79.75,76.55) ; v2(79.39,30.02) 80.55,30.02 R17.2 R18.2 R19.2 ; v2(65.65,46.57) 65.65,47.02 65.52,47.15 U1.13 ; v2(22.4,119.08) 22.4,119.97 C11.2 C12.2 21.2,118.93 U13.7 U13.6 ; v2(61.58,17.3) 62.02,17.3 R178.2 ; U21.1 9.28,10.32 v2(9.5,10.32) ; v2(79.68,46.59) 80.73,46.59 R25.2 R26.2 R27.2 ; U20.3 10.45,60.15 10.62,60.32 ; U1.64 57.57,49.12 C4.2 57.06,48.8 v2(55.9,49.96) ; v2(4.33,82.27) 5.15,83.1 R181.1 ; R4.2 R3.2 R2.2 80.62,13.53 v2(79.75,13.53) ; R151.2 1.95,61.55 v2(1.1,62.4) ; v2(32.58,107) 34.91,107 U25.4 U25.5 ; R168.1 29.8,113.17 v2(28.75,113.17) ; R51.2 R50.2 R49.2 80.67,95.55 v2(79.73,95.55) ; v2(79.3,107.9) 80.59,109.19 R59.2 R58.2 R57.2 ; 65.45,43.65 66.77,43.65 v2(66.83,43.7) ; v2(78,63.95) 78.08,63.95 78.63,63.4 79.13,63.4 R33.2 R34.2 R35.2 ; v2(61.83,76.95) 59.9,78.88 R106.2 ; v1(65.72,35.62) 65.09,36.25 R175.1 R174.1 ; 33.58,100.02 32.82,100.02 32.78,100.06 30.92,100.06 30.84,99.98 30.47,99.98 30.24,99.75 R161.2 ; U20.24 16.35,61.45 v2(16.82,60.98) ; v2(72.7,59.47) 70.58,59.47 C5.2 69.6,58.04 U1.32 ; CN8.1 34.9,121.44 v1(35.72,120.62) ; U12.9 62.52,110.88 v2(64.63,110.88) ; U11.9 64.67,90.77 v2(64.85,90.95) ; 11.85,67.1 12.08,67.32 v2(12.08,68.2) ; U1.19 68.98,50.93 C6.2 70.95,51.2 v2(70.33,51.82) ; U9.2 3.73,84.9 C8.2 3.62,84.52 v2(2.45,83.35) ; 33.33,99.8 33.3,99.77 32.98,99.77 32.69,100.06 ; R180.1 20.42,107.15 v2(21.23,106.35) ; R185.1 1.65,68.8 v2(1.33,68.8) 1.33,69.02 R171.2 ; v2(70.52,106.77) 69.63,105.88 69.4,105.88 ; v2(59.63,66.38) 59.57,66.32 59.57,63.7 59.57,63.7 59.57,61.22 59.55,61.2 59.55,59.36 U1.48 ; 14.6,9.6 v2(15.28,10.28)
  vias: v1(5.72,130.62) v1(5.72,100.62) v1(5.72,95.62) v1(5.72,90.62) v1(5.72,80.62) v1(5.72,60.62) v1(10.72,120.62) v1(10.72,100.62) v1(10.72,90.62) v1(10.72,60.62) v1(15.72,115.62) v1(15.72,95.62) v1(15.72,35.62) v1(15.72,25.62) v1(15.72,15.62) v1(20.72,130.62) v1(20.72,80.37) v1(20.72,75.62) v1(20.72,70.62) v1(20.72,65.62) v1(20.72,60.62) v1(20.72,55.62) v1(20.72,50.62) v1(20.72,45.62) v1(20.72,40.62) v1(20.72,35.62) v1(20.72,30.62) v1(25.72,130.62) v1(25.72,95.62) v1(25.84,10.17) v1(26.42,44.4) v1(30.72,55.62) v1(30.72,25.62) v1(30.72,20.62) v1(35.72,25.62) v1(40.72,130.62) v1(40.72,85.3) v1(40.72,25.62) v1(45.72,130.62) v1(45.72,120.62) v1(45.72,110.62) v1(45.72,85.47) v1(45.72,25.62) v1(50.72,130.62) v1(50.72,125.62) v1(50.72,115.62) v1(50.72,110.62) v1(55.72,130.62) v1(55.72,125.62) v1(55.72,15.62) v1(57.39,4.97) v1(60.72,130.62) v1(60.72,90.62) v1(60.72,85.62) v1(65.72,130.62) v1(65.72,120.82) v1(65.72,115.62) v1(65.72,70.62) v1(70.72,130.62) v1(70.72,125.62) v1(70.72,120.62) v1(70.72,75.62) v1(70.72,5.62) v1(75.47,95.82) v1(75.72,130.62) v1(75.72,125.62) v1(75.72,100.62) v1(75.72,75.62) v1(75.72,25.62) v1(75.72,20.62) v1(75.72,5.62) v1(80.72,130.62) v1(80.72,125.62) v1(80.72,5.62) v2(12.85,3.6) v2(15.85,26.78) v2(18.03,1.78) v2(21.04,5.24) v2(21.7,1.72) v2(24.62,5.22) v2(33.9,99.1) v2(34.86,99.79) v2(35.6,99.17) v2(36.35,99.75) v2(80.17,58.32)
3V3_EN: length 45
  Top Layer w0.254: U16.2 42.33,121.97 v2(42.3,122) 43.33,122 R133.2
  Inner1 w0.254: v2(42.3,122) 45.17,122 51.4,128.22 74.3,128.22 76.92,125.6 SW16.1
5V: length 71.9
  Top Layer w0.254: v2(65.22,118.88) 64.62,119.47 U31.6 ; 14.73,121.4 14.44,121.11 ; 14.73,121.4 14.35,121.4 ; 14.73,121.4 U26.7 U26.2 16.88,121.4 ; 14.44,121.11 14.14,121.11 14.1,121.15 ; 14.44,121.11 14.2,120.88 ; 14.44,121.11 14.44,121.31 14.35,121.4 ; 14.35,121.4 14.1,121.15 ; 14.35,121.4 13.83,121.4 12.94,120.51 ; 14.2,120.88 13.83,120.5 ; 14.2,120.88 13.83,120.88 ; 13.83,120.5 13.83,120.88 ; 13.83,120.5 13.83,120 R167.2 ; 14.1,121.15 13.83,120.88 ; v2(18.25,120.32) 18.25,121.15 18,121.4 16.88,121.4 ; v2(17.25,120.32) 17.14,120.44 17.14,121.15 16.88,121.4
  Inner2 w0.254: v2(65.22,118.88) 65.13,118.8 24,118.8 19.35,114.15 15.42,114.15 12.16,117.41 v2(12.16,119.06)
  vias: v2(2.92,121.15) v2(2.92,120.2) v2(3.92,121.2) v2(3.9,120.2) v2(4.88,121.17) v2(4.85,120.2) v2(12.95,120.34) v2(17.24,119.62) v2(18.29,119.62)
5V_DAC: length 16.8
  Top Layer w0.2: U31.5 63.69,118.97 63.6,119.07 63.6,119.96 63.58,119.97
  Top Layer w0.254: U29.13 69.81,118.6 69.79,118.58 ; U29.16 U29.15 70.77,117.6 69.79,118.58 ; 69.79,118.58 68.4,119.97 U31.7 U31.2 61.92,119.97 61.75,120.15 R184.2
5V_LDO: length 35
  Top Layer w0.254: U30.3 58.45,93.84 C50.2 62.05,94.1 62.05,102.05 60.33,103.77 60.33,117.52 62.27,119.47 ; R182.1 62.27,117.73 62.27,119.47 ; 62.27,119.47 U31.3
5VTO3V3: length 5.7
  Top Layer w0.254: 30.15,100.6 30.19,100.56 30.49,100.56 ; 10.73,114.4 R156.2 10.73,112.5 11.58,111.65 11.98,111.65 12.42,111.2 12.42,110.92 ; 30.92,100.56 30.49,100.56 ; 30.49,100.56 30.15,100.9
  vias: v2(13.58,106.85) v2(14.6,106.8) v2(15.7,106.82) v2(16.62,106.85) v2(24.78,101.35) v2(25.65,101.38) v2(26.45,101.35)
12V: length 24.9
  Top Layer w0.254: R134.1 55.83,119.07 58.02,119.07 59.2,117.9 59.2,103.62 56.62,101.04 L2.2
12V_EN: length 21
  Top Layer w0.254: R132.2 55.1,119.82 v2(54.42,119.82) 53.96,119.36 U15.2
  Inner1 w0.254: SW15.1 65.83,125.82 65.38,126.27 61.17,126.27 54.72,119.82 v2(54.42,119.82)
GND: length 338.1
  Top Layer w0.2: v2(84.85,59.71) 84.8,59.65 83.92,59.65 83.65,59.38 U24.2
  Top Layer w0.254: 49.58,52.87 52.32,52.87 52.63,53.17 52.63,58.42 51.87,59.18 R87.1 ; 49.58,52.87 50.16,52.29 50.16,52.16 ; 49.58,52.87 48.08,52.87 47.57,52.36 47.57,52.15 ; 50.16,40.75 50.16,40.88 49.58,41.46 ; 88.55,51.82 88.55,48.57 ; 88.55,48.57 89.05,49.07 ; 88.55,48.57 U4.49 89.05,47.57 ; 63.9,23.05 63.25,23.7 U10.15 ; 63.9,23.05 64.55,22.4 ; 63.9,23.05 U10.16 ; v2(10.22,3.1) 9.57,2.45 U21.12 ; 89.23,96.52 88.98,96.27 U7.8 ; 89.23,96.52 89.48,96.27 ; 89.23,96.52 89.48,96.27 ; 89.23,96.52 U7.49 89.23,98.52 ; v2(76.35,92.75) 77.35,92.75 C60.1 ; C61.1 79.23,78.9 v2(79.67,79.35) ; 88.23,98.52 88.48,98.77 U7.30 ; 47.55,63.71 47.55,64.02 48.05,64.53 49.55,64.53 49.63,64.45 ; 89.17,65.85 88.92,65.6 ; 89.17,65.85 89.92,66.6 U5.22 ; 89.17,65.85 89.43,66.1 U5.21 ; 88.92,65.6 U5.29 ; 88.92,65.6 v2(88.68,65.35) U5.49 v2(88.69,64.33) 88.92,64.1 U5.8 ; U5.30 88.42,66.1 88.17,65.85 ; v2(84.85,59.71) 84.29,60.27 ; U2.30 88.38,15.46 ; 88.38,15.46 88.88,15.96 ; 88.38,15.46 U2.49 88.88,14.46 ; 49.4,6.36 47.9,6.36 47.4,5.85 47.4,5.64 ; 49.4,6.36 49.44,6.4 52.1,6.4 52.55,6.85 52.55,12 51.89,12.66 51.31,12.66 ; 49.4,6.36 49.98,5.78 49.98,5.66 ; v2(60.48,67.25) 60.48,60.5 60.02,60.05 60.02,59.34 U1.47 ; 49.63,64.45 52.08,64.45 52.75,65.12 52.75,70.12 52.1,70.78 R94.1 ; 49.63,64.45 50.13,63.95 50.13,63.72 ; 72.6,58.32 71.19,56.91 U1.31 ; v2(102.05,6.7) 101.98,6.62 C70.1 ; 49.45,17.92 50.03,17.35 50.03,17.22 ; 49.45,17.92 49.48,17.95 52.25,17.95 52.73,18.42 52.73,23.65 52.17,24.2 R66.1 ; 49.45,17.92 47.95,17.92 47.45,17.42 47.45,17.2 ; 89.23,98.52 88.98,98.77 U7.29 ; 89.23,98.52 89.98,99.27 U7.22 ; 89.23,98.52 89.48,98.77 U7.21 ; v2(102.38,106) 102.29,105.92 C64.1 ; U3.21 89.26,33.01 ; 89.26,33.01 89.76,33.51 U3.22 ; 89.26,33.01 89.01,32.76 ; 88.76,28.26 88.76,31.01 ; 88.76,31.01 89.26,30.51 ; 88.76,31.01 U3.49 88.26,32.01 ; U4.15 90.05,46.57 89.55,47.07 ; 89.38,16.46 89.13,16.21 88.88,15.96 ; 89.38,16.46 89.88,16.96 U2.22 ; 89.38,16.46 U2.21 ; U3.15 89.76,30.01 89.26,30.51 ; 89.18,82.18 88.18,81.18 ; 89.18,82.18 88.93,82.43 U6.29 ; 89.18,82.18 89.43,82.43 ; 89.18,82.18 89.43,82.43 ; C66.1 102.09,73.12 v2(102.17,73.19) ; 64.55,22.4 64.55,21.45 v2(64.95,21.05) ; 64.55,22.4 U10.17 ; 88.76,35.26 88.76,33.01 89.01,32.76 ; 89.55,47.07 U4.16 ; 89.55,47.07 89.3,47.32 89.05,47.57 ; U2.16 89.38,13.96 ; 89.38,13.96 88.88,14.46 ; 89.38,13.96 89.88,13.46 U2.15 ; v2(25.2,120.45) 25.2,122.02 24.78,122.45 24.03,122.45 23.62,122.05 D1.2 ; 49.55,75.88 52.25,75.88 52.77,76.4 52.77,81.5 52.07,82.2 R101.1 ; 49.55,75.88 48.05,75.88 47.54,75.37 R103.1 ; 49.55,75.88 50.13,75.3 R105.1 ; U5.15 89.92,63.1 89.42,63.6 ; v2(23.58,115.67) 24.08,116.17 U13.3 ; R80.1 52.12,47.78 52.65,47.25 52.65,41.82 52.28,41.46 49.58,41.46 ; 47.5,28.87 47.5,29.08 48,29.58 49.5,29.58 ; 89.43,79.93 89.93,79.43 U6.15 ; 89.43,79.93 89.18,80.18 88.93,79.93 U6.8 ; 89.43,79.93 U6.16 ; v2(65.3,32.78) 65.85,32.22 U10.10 ; 89.48,96.27 89.98,95.77 U7.15 ; 89.48,96.27 U7.16 ; 89.42,63.6 89.17,63.85 ; 89.42,63.6 U5.16 ; U8.8 88.73,113.12 U8.49 88.23,114.12 ; 88.88,15.96 U2.29 ; 88.18,82.18 88.43,82.43 U6.30 ; 91.68,82.43 89.43,82.43 ; 89.43,82.43 89.93,82.93 U6.22 ; v2(38.08,106.47) 38.05,106.45 U25.2 ; U2.8 88.88,14.46 ; 89.55,49.57 90.05,50.07 U4.22 ; 89.55,49.57 U4.21 ; 89.55,49.57 89.3,49.32 89.05,49.07 ; U8.30 88.23,114.12 ; 88.23,114.12 88.73,114.62 U8.29 ; U29.14 73.27,118.1 v2(73.52,117.85) 74.27,118.6 U29.8 ; 49.58,41.46 48.08,41.46 47.57,40.95 47.57,40.74 ; v2(79.45,112.27) 78.67,111.5 C59.1 ; C68.1 101.93,40.12 v2(101.98,40.18) ; C62.1 76.1,57.25 76.1,55.07 v2(77.27,53.9) ; v2(102.23,56.77) 102.15,56.7 C67.1 ; C4.1 57.45,47.4 58.95,48.9 58.95,50.02 58.56,50.41 U1.63 56.59,50.41 v2(56.24,50.76) ; C63.1 102.23,122.35 v2(102.3,122.42) ; C69.1 101.99,23.55 v2(102.05,23.61) ; 49.5,29.58 49.52,29.6 52.3,29.6 52.7,30 52.7,35.47 52.27,35.9 R73.1 ; 49.5,29.58 50.08,29.01 50.08,28.88 ; 88.26,32.01 89.01,32.76 ; 88.26,32.01 88.26,35.26 ; 89.05,47.57 U4.8 ; 89.26,30.51 U3.16 ; D2.2 7.15,121.48 v2(8.08,120.55) ; 89.05,49.07 U4.29 ; U1.18 69.94,50.41 70.2,50.15 70.2,49.65 v2(69.5,48.95) 70.37,48.95 C6.1 ; U21.21 v2(12.78,7.65) ; C65.1 102.08,89.67 v2(102.13,89.72) ; v2(64.77,46.57) 64.77,46.93 65.05,47.21 65.05,47.94 U1.12
  vias: v1(3.39,72.82) v1(5.34,58.2) v1(5.52,101.6) v1(5.52,48.8) v1(5.52,10.4) v1(5.8,102.4) v1(5.8,97.32) v1(5.8,92.24) v1(5.8,82.08) v1(5.8,66.84) v1(5.8,51.6) v1(5.8,46.52) v1(5.8,41.44) v1(5.8,36.36) v1(5.8,31.28) v1(5.8,26.2) v1(5.8,21.12) v1(5.8,16.04) v1(5.8,10.96) v1(10.32,130.4) v1(10.32,101.6) v1(10.88,102.4) v1(10.88,97.32) v1(10.88,92.24) v1(10.88,61.76) v1(15.12,96.8) v1(15.12,29.6) v1(15.96,127.8) v1(15.96,112.56) v1(15.96,102.4) v1(15.96,97.32) v1(15.96,92.24) v1(15.96,31.28) v1(15.96,21.12) v1(19.92,111.2) v1(19.92,72.8) v1(19.92,15.2) v1(19.92,10.4) v1(21.04,107.48) v1(21.04,82.08) v1(21.04,77) v1(21.04,71.92) v1(21.04,56.68) v1(21.04,51.6) v1(21.04,41.44) v1(21.04,36.36) v1(21.04,26.2) v1(21.04,21.12) v1(21.04,16.04) v1(21.04,10.96) v1(21.27,48.07) v1(21.42,62.77) v1(24.72,130.4) v1(24.72,44) v1(24.72,39.2) v1(24.72,29.6) v1(24.72,24.8) v1(24.72,15.2) v1(24.72,10.4) v1(26.12,107.48) v1(26.12,97.32) v1(26.12,92.24) v1(26.12,26.2) v1(26.12,21.12) v1(29.52,92) v1(29.52,29.6) v1(31.2,112.56) v1(31.2,71.92) v1(31.2,5.88) v1(34.32,111.2) v1(34.32,29.6) v1(36.28,122.72) v1(36.28,117.64) v1(36.28,97.32) v1(39.12,130.4) v1(39.12,116) v1(39.12,111.2) v1(39.12,106.4) v1(39.12,92) v1(39.12,29.6) v1(41.36,127.8) v1(41.36,122.72) v1(43.92,130.4) v1(43.92,125.6) v1(43.92,106.4) v1(46.44,127.8) v1(46.44,117.64) v1(46.44,112.56) v1(46.44,107.48) v1(46.44,71.92) v1(46.44,16.04) v1(46.44,5.88) v1(48.72,130.4) v1(48.72,120.8) v1(48.72,116) v1(48.72,111.2) v1(48.72,106.4) v1(48.72,48.8) v1(48.84,95.37) v1(48.85,94.31) v1(51.52,117.64) v1(51.52,107.48) v1(53.52,130.4) v1(53.52,125.6) v1(53.52,120.8) v1(53.52,106.4) v1(53.52,87.2) v1(53.52,72.8) v1(53.52,38.47) v1(53.52,15.2) v1(56.6,122.72) v1(56.6,107.48) v1(56.6,102.4) v1(56.6,16.04) v1(56.57,5.58) v1(58.32,130.4) v1(58.34,116.05) v1(58.32,111.2) v1(58.32,106.4) v1(58.32,68) v1(58.32,5.6) v1(58.44,120.45) v1(60.2,102.17) v1(60.83,96.84) v1(61.68,71.92) v1(61.68,10.96) v1(63.12,130.4) v1(63.12,125.6) v1(66.53,112.56) v1(66.52,109.35) v1(66.76,10.96) v1(66.76,5.88) v1(67.92,130.4) v1(67.92,120.8) v1(67.92,116) v1(67.92,87.2) v1(67.92,44) v1(71.01,119.28) v1(71.04,114.87) v1(71.84,77) v1(71.84,10.96) v1(72.72,130.4) v1(72.72,125.6) v1(72.72,29.6) v1(72.72,24.8) v1(72.72,20) v1(76.92,127.8) v1(76.92,102.4) v1(76.92,26.2) v1(76.92,10.96) v1(76.92,5.88) v1(77.52,130.4) v1(77.52,125.6) v1(77.52,44) v1(77.52,5.6) v1(82,127.8) v1(82,5.88) v1(82.32,130.4) v1(82.32,125.6) v1(85.97,115.93) v1(85.99,111.88) v1(86,33.82) v1(86.02,29.77) v1(86.12,17.27) v1(86.14,13.22) v1(86.22,99.57) v1(86.24,95.52) v1(86.17,83.24) v1(86.19,79.19) v1(86.17,66.91) v1(86.19,62.86) v1(86.29,50.38) v1(86.31,46.33) v1(86.45,115.39) v1(86.47,112.4) v1(86.48,33.28) v1(86.5,30.29) v1(86.65,66.37) v1(86.6,16.73) v1(86.62,13.74) v1(86.7,99.03) v1(86.72,96.04) v1(86.66,82.7) v1(86.68,79.71) v1(86.67,63.38) v1(86.77,49.84) v1(86.79,46.85) v1(89.5,115.36) v1(89.47,112.34) v1(89.53,33.25) v1(89.5,30.23) v1(89.63,13.68) v1(89.72,95.98) v1(89.7,82.67) v1(89.68,79.65) v1(89.7,66.34) v1(89.67,63.32) v1(89.65,16.7) v1(89.75,99) v1(89.82,49.81) v1(89.79,46.79) v1(90,115.87) v1(90,111.88) v1(90.03,33.76) v1(90.03,29.77) v1(90.25,95.52) v1(90.21,83.18) v1(90.2,79.19) v1(90.2,66.85) v1(90.2,62.86) v1(90.16,17.21) v1(90.15,13.22) v1(90.25,99.51) v1(90.32,50.32) v1(90.32,46.33) v2(2.38,86.15) v2(2.5,106.69) v2(3.4,1.88) v2(6.59,111.75) v2(7.48,111.72) v2(7.62,96.47) v2(7.62,94.97) v2(7.6,93.55) v2(8.45,111.8) v2(8.75,97.7) v2(8.75,92.32) v2(10.03,53.42) v2(10.13,8.61) v2(10.15,97.75) v2(10.15,92.35) v2(11.62,97.67) v2(11.58,92.47) v2(11.94,60.56) v2(12.79,96.47) v2(12.83,95) v2(12.8,93.62) v2(16.1,117.82) v2(16.85,59.55) v2(17.24,118.11) v2(18.71,118.38) v2(20.73,112.62) v2(22.75,115.67) v2(23.58,116.51) v2(23.58,114.84) v2(24.37,115.67) v2(28.7,103.47) v2(28.7,102.42) v2(30.53,1.7) v2(31,5.1) v2(31.08,98.33) v2(31.08,97.32) v2(31.12,74.65) v2(31.12,63.22) v2(31.17,51.57) v2(31.23,28.35) v2(31.15,16.62) v2(31.29,40.29) v2(32.1,98.3) v2(32.15,97.32) v2(33.4,98.24) v2(33.37,97.32) v2(38.65,28.45) v2(38.7,74.65) v2(38.7,51.71) v2(38.73,5.17) v2(38.77,63.25) v2(38.79,40.31) v2(38.88,16.74) v2(40.25,117.02) v2(40.3,116.07) v2(40.3,115.15) v2(41.38,95.67) v2(43.38,124.85) v2(46.08,16.65) v2(46.13,5.17) v2(46.23,63.22) v2(46.23,51.55) v2(46.29,74.52) v2(46.33,40.22) v2(46.26,28.34) v2(46.7,119.45) v2(48.6,97.45) v2(48.85,96.52) v2(50.73,99.35) v2(51.45,115.02) v2(52.05,114.67) v2(52.08,113.8) v2(55.75,123.33) v2(55.8,60.02) v2(56.98,62.67) v2(61.35,122.9) v2(62.08,120.82) v2(62.23,0.85) v2(63.73,90.92) v2(65.02,113.45) v2(66.98,66.72) v2(68.88,118.22) v2(72.3,54.47) v2(75.5,74.45) v2(76.15,68.12) v2(77.25,4.5) v2(78.55,67.75) v2(78.88,100.15) v2(78.9,5.82) v2(79,50.82) v2(79.13,116.43) v2(79.1,3.25) v2(79.77,55.9) v2(82.63,34.4) v2(82.8,17.82) v2(83.48,83.7) v2(85.97,114.87) v2(85.98,113.87) v2(85.95,112.88) v2(86,32.76) v2(86.01,31.76) v2(85.98,30.77) v2(86.15,63.86) v2(86.12,16.21) v2(86.13,15.21) v2(86.1,14.22) v2(86.22,98.51) v2(86.23,97.51) v2(86.2,96.52) v2(86.17,82.18) v2(86.18,81.18) v2(86.16,80.19) v2(86.17,65.85) v2(86.18,64.85) v2(86.29,49.32) v2(86.3,48.32) v2(86.27,47.33) v2(86.46,114.39) v2(86.46,113.35) v2(86.48,32.28) v2(86.48,31.24) v2(86.61,15.72) v2(86.61,14.69) v2(86.71,98.03) v2(86.71,96.99) v2(86.66,81.7) v2(86.66,80.66) v2(86.65,65.36) v2(86.65,64.33) v2(86.78,48.83) v2(86.78,47.8) v2(87,115.89) v2(86.97,111.85) v2(87.02,33.78) v2(87,29.74) v2(87.15,17.23) v2(87.12,13.19) v2(87.25,99.53) v2(87.22,95.49) v2(87.2,83.2) v2(87.18,79.16) v2(87.19,66.87) v2(87.17,62.83) v2(87.32,50.34) v2(87.29,46.3) v2(87.46,115.43) v2(87.5,114.4) v2(87.48,113.35) v2(87.48,112.32) v2(87.49,33.32) v2(87.53,32.29) v2(87.51,31.24) v2(87.51,30.21) v2(87.61,16.77) v2(87.63,14.69) v2(87.63,13.66) v2(87.71,99.07) v2(87.73,96.99) v2(87.73,95.96) v2(87.66,82.74) v2(87.71,81.71) v2(87.68,80.66) v2(87.68,79.63) v2(87.66,66.41) v2(87.7,65.38) v2(87.67,64.32) v2(87.67,63.3) v2(87.66,15.74) v2(87.75,98.04) v2(87.78,49.88) v2(87.82,48.85) v2(87.8,47.8) v2(87.8,46.77) v2(87.99,115.88) v2(87.99,111.81) v2(88.02,33.77) v2(88.02,29.7) v2(88.14,17.22) v2(88.14,13.15) v2(88.24,99.52) v2(88.24,95.46) v2(88.19,83.19) v2(88.19,79.12) v2(88.19,66.86) v2(88.19,62.79) v2(88.31,50.33) v2(88.31,46.26) v2(88.5,115.43) v2(88.48,114.38) v2(88.49,113.36) v2(88.52,112.32) v2(88.52,33.32) v2(88.51,32.26) v2(88.52,31.24) v2(88.54,30.21) v2(88.65,16.77) v2(88.64,15.71) v2(88.64,14.69) v2(88.75,99.07) v2(88.73,98.02) v2(88.74,97) v2(88.7,82.74) v2(88.69,81.69) v2(88.69,80.67) v2(88.72,79.63) v2(88.69,66.41) v2(88.71,63.3) v2(88.67,13.66) v2(88.77,95.96) v2(88.82,49.88) v2(88.81,48.82) v2(88.81,47.8) v2(88.84,46.77) v2(89,115.9) v2(88.99,111.82) v2(89.03,33.79) v2(89.02,29.71) v2(89.14,13.16) v2(89.24,95.46) v2(89.2,83.21) v2(89.2,79.13) v2(89.2,66.88) v2(89.19,62.8) v2(89.15,17.24) v2(89.25,99.55) v2(89.32,50.35) v2(89.31,46.27) v2(89.52,114.39) v2(89.52,113.35) v2(89.55,32.28) v2(89.55,31.24) v2(89.73,81.7) v2(89.73,80.66) v2(89.72,65.36) v2(89.72,64.33) v2(89.67,15.72) v2(89.67,14.69) v2(89.77,98.03) v2(89.77,96.99) v2(89.84,48.83) v2(89.84,47.8) v2(90.02,114.88) v2(90.02,113.87) v2(90.02,112.84) v2(90.05,32.76) v2(90.05,31.76) v2(90.05,30.73) v2(90.23,82.19) v2(90.22,81.18) v2(90.22,80.15) v2(90.22,65.85) v2(90.21,64.85) v2(90.22,63.82) v2(90.17,16.21) v2(90.17,15.21) v2(90.17,14.18) v2(90.27,98.52) v2(90.27,97.51) v2(90.27,96.48) v2(90.34,49.32) v2(90.34,48.32) v2(90.34,47.29) v3(85.49,115.4) v3(85.49,114.35) v3(85.49,113.35) v3(85.48,112.34) v3(85.51,33.29) v3(85.51,32.24) v3(85.51,31.24) v3(85.5,30.23) v3(85.64,16.74) v3(85.64,15.69) v3(85.64,14.69) v3(85.63,13.68) v3(85.74,99.04) v3(85.74,97.99) v3(85.74,96.99) v3(85.73,95.98) v3(85.69,82.71) v3(85.69,81.66) v3(85.69,80.66) v3(85.68,79.65) v3(85.68,66.38) v3(85.68,65.33) v3(85.68,64.33) v3(85.67,63.31) v3(85.81,49.85) v3(85.81,48.8) v3(85.81,47.8) v3(85.8,46.79) v3(86.49,116.36) v3(86.46,111.4) v3(86.52,34.25) v3(86.49,29.29) v3(86.64,17.7) v3(86.61,12.74) v3(86.74,100) v3(86.71,95.04) v3(86.7,83.67) v3(86.66,78.71) v3(86.69,67.34) v3(86.66,62.38) v3(86.81,50.81) v3(86.78,45.85) v3(87.5,116.35) v3(87.51,111.4) v3(87.53,34.24) v3(87.54,29.29) v3(87.71,83.66) v3(87.71,78.71) v3(87.7,67.32) v3(87.71,62.38) v3(87.66,17.69) v3(87.66,12.74) v3(87.75,99.99) v3(87.76,95.04) v3(87.82,50.8) v3(87.83,45.85) v3(88.5,116.35) v3(88.51,111.4) v3(88.53,34.24) v3(88.54,29.29) v3(88.71,83.66) v3(88.71,78.71) v3(88.7,67.32) v3(88.71,62.38) v3(88.66,17.69) v3(88.66,12.74) v3(88.75,99.99) v3(88.76,95.04) v3(88.82,50.8) v3(88.83,45.85) v3(89.52,111.39) v3(89.55,29.28) v3(89.55,116.35) v3(89.58,34.24) v3(89.72,78.7) v3(89.72,62.37) v3(89.71,17.69) v3(89.67,12.73) v3(89.8,99.99) v3(89.77,95.03) v3(89.76,83.66) v3(89.75,67.32) v3(89.84,45.84) v3(89.87,50.8) v3(90.48,115.4) v3(90.48,114.35) v3(90.48,113.35) v3(90.47,112.34) v3(90.51,33.29) v3(90.51,32.24) v3(90.51,31.24) v3(90.5,30.23) v3(90.64,16.74) v3(90.64,15.69) v3(90.64,14.69) v3(90.63,13.68) v3(90.73,99.04) v3(90.73,97.99) v3(90.73,96.99) v3(90.72,95.98) v3(90.69,82.71) v3(90.69,81.66) v3(90.69,80.66) v3(90.68,79.65) v3(90.68,66.38) v3(90.68,65.33) v3(90.68,64.33) v3(90.67,63.31) v3(90.8,49.85) v3(90.8,48.8) v3(90.8,47.8) v3(90.79,46.79)
BOOT0: length 104.9
  Top Layer w0.254: U1.60 56.56,51.91 v2(56.27,52.2) ; R139.2 55.68,58.42 v2(55.77,58.32) ; U9.28 17.75,105.17 v2(17.75,102.25)
  Inner1 w0.254: v2(55.77,58.32) 54.23,58.32 52.8,56.9 52.8,53.2 53.8,52.2 v2(56.27,52.2)
  Inner2 w0.254: v2(55.77,58.32) 52.85,58.32 50.65,60.52 22.12,60.52 19.15,57.55 17.17,57.55 15.48,59.25 15.48,61.8 14.1,63.17 14.1,98.6 v2(17.75,102.25)
BOOT1: length 14
  Top Layer w0.254: v2(66.1,62.75) 66.15,62.8 R138.1 ; v2(65.5,54.3) 67.1,54.3 68.21,55.41 U1.28
  Inner2 w0.254: v2(66.1,62.75) 66.1,62.35 65.4,61.65 65.4,54.41 v2(65.5,54.3)
C1_AGC: length 105.9
  Top Layer w0.254: SW8.2 19.31,5.1 v2(19.31,8.21) 19.31,11.35 19.65,11.69 45.76,11.69 45.9,11.84 48.08,11.84 48.42,11.5 48.42,11.16 ; U2.2 U2.1 85.38,9.56 83.42,7.6 57.73,7.6 v2(57.33,8)
  Inner2 w0.254: v2(57.33,8) 57.08,8.25 19.35,8.25 v2(19.31,8.21)
C1_BOOST: length 54
  Top Layer w0.254: 41.24,12.76 DP2.7 DP2.6 DP2.5 46.02,12.76 v2(46.02,12.75) ; v2(88.85,8.28) 87.88,9.24 U2.6
  Inner2 w0.254: v2(88.85,8.28) 88.85,8.9 87.52,10.22 55.69,10.22 55.34,9.88 48.9,9.88 v2(46.02,12.75)
C1_CLIM0: length 96.9
  Top Layer w0.254: U2.3 86.38,9.86 83.63,7.1 v2(56.85,7.1) ; R9.2 23.58,11.16 23.08,10.65 23.08,7.69 v2(22.99,7.61) 22.99,5.13 SW1.2 23.09,5.11
  Inner2 w0.254: v2(56.85,7.1) 56.32,7.63 23.02,7.63 v2(22.99,7.61)
C1_CLIM1: length 66.7
  Top Layer w0.254: U2.4 86.88,8.59 v2(87.2,8.28) ; DP1.8 DP1.7 DP1.6 DP1.5 v2(31.12,12.73) 31.12,12.72
  Inner2 w0.254: v2(31.12,12.73) 35.03,8.82 55.88,8.82 56.13,9.07 86.4,9.07 v2(87.2,8.28)
C1_CLK: length 67.7
  Top Layer w0.254: U2.43 58.89,14.96 54.5,19.35 54.5,51.47 55.9,52.88 57.53,52.88 U1.58
C1_DIR: length 64.9
  Top Layer w0.254: U2.42 62.66,15.46 62.26,15.86 v2(61.5,15.86) ; v2(59.65,53.12) 58.86,53.91 U1.56
  Inner2 w0.254: v2(61.5,15.86) 60.21,15.86 59.25,16.82 59.25,51.72 59.75,52.22 59.75,53.02 v2(59.65,53.12)
C1_DMODE0: length 22.5
  Top Layer w0.254: U10.23 68.45,17.82 69.31,16.96 U2.39
C1_DMODE1: length 23.5
  Top Layer w0.254: 67.8,23.77 U10.22 67.8,22.16 67.79,22.15 67.79,17.63 68.96,16.46 U2.40
C1_DMODE2: length 24.5
  Top Layer w0.254: 67.1,23.69 67.15,23.75 ; 67.15,23.75 U10.21 ; 67.15,23.75 67.15,17.36 68.55,15.96 U2.41
C1_EN: length 65.5
  Top Layer w0.254: U1.57 58.59,53.41 59.07,52.93 59.07,52.57 ; v2(61.17,13.97) 61.66,14.46 U2.44
  Inner2 w0.254: v2(61.17,13.97) 58.65,16.5 58.65,52.1 v2(59.07,52.52)
C1_FLIM: length 60.6
  Top Layer w0.254: U2.5 87.38,8.92 v2(88.02,8.28) ; DP3.8 DP3.7 DP3.6 DP3.5 v2(38.73,12.76)
  Inner2 w0.254: v2(88.02,8.28) 88.02,9.06 87.48,9.6 55.92,9.6 55.64,9.32 42.16,9.32 v2(38.73,12.76)
C1_LO1: length 26.9
  Top Layer w0.254: U10.24 69.1,19.72 v2(69.17,19.65) ; U2.47 83.91,12.96 83.3,12.35 TP2.1 82.28,12.17 R3.1 81.48,11.37 81.48,10.07 81.15,9.75 79.82,9.75 78.65,10.92 78.65,10.92 76.8,12.78 76.8,13.38 76.45,13.72 v2(75.02,13.72)
  Inner1 w0.254: v2(75.02,13.72) 70.98,17.78 70.04,17.78 69.17,18.64 v2(69.17,19.65)
C1_LO2: length 26.5
  Top Layer w0.254: v2(76.01,12.87) 76.01,12.82 79.55,9.28 81.5,9.28 82.25,10.02 R4.1 82.26,10.88 TP3.1 83.4,10.97 83.67,10.97 83.85,11.15 83.85,11.97 84.34,12.46 U2.48 ; v2(69.93,20.15) 69.75,20.33 U10.25
  Inner1 w0.254: v2(76.01,12.87) 76.01,13.82 71.3,18.53 70.35,18.53 69.93,18.95 v2(69.93,20.15)
C1_MO: length 2.4
  Top Layer w0.254: U2.46 83.31,13.46 TP1.1 82.29,13.46 R2.1
